# EasyEDA Pro project LCEDAsucai.epro

# Schematic Schematic1

## Sheets
1 BTB: Assembly Variant: Basic; Board Name: tv基板; Create Date: 2026-03-27; Page Name: BTB; Project Name: LCEDAsucaiku; Schematic Name: Schematic1; Update Date: 2026-05-01; Company: 嘉立创EDA; Page Size: A4; Version: V1.0
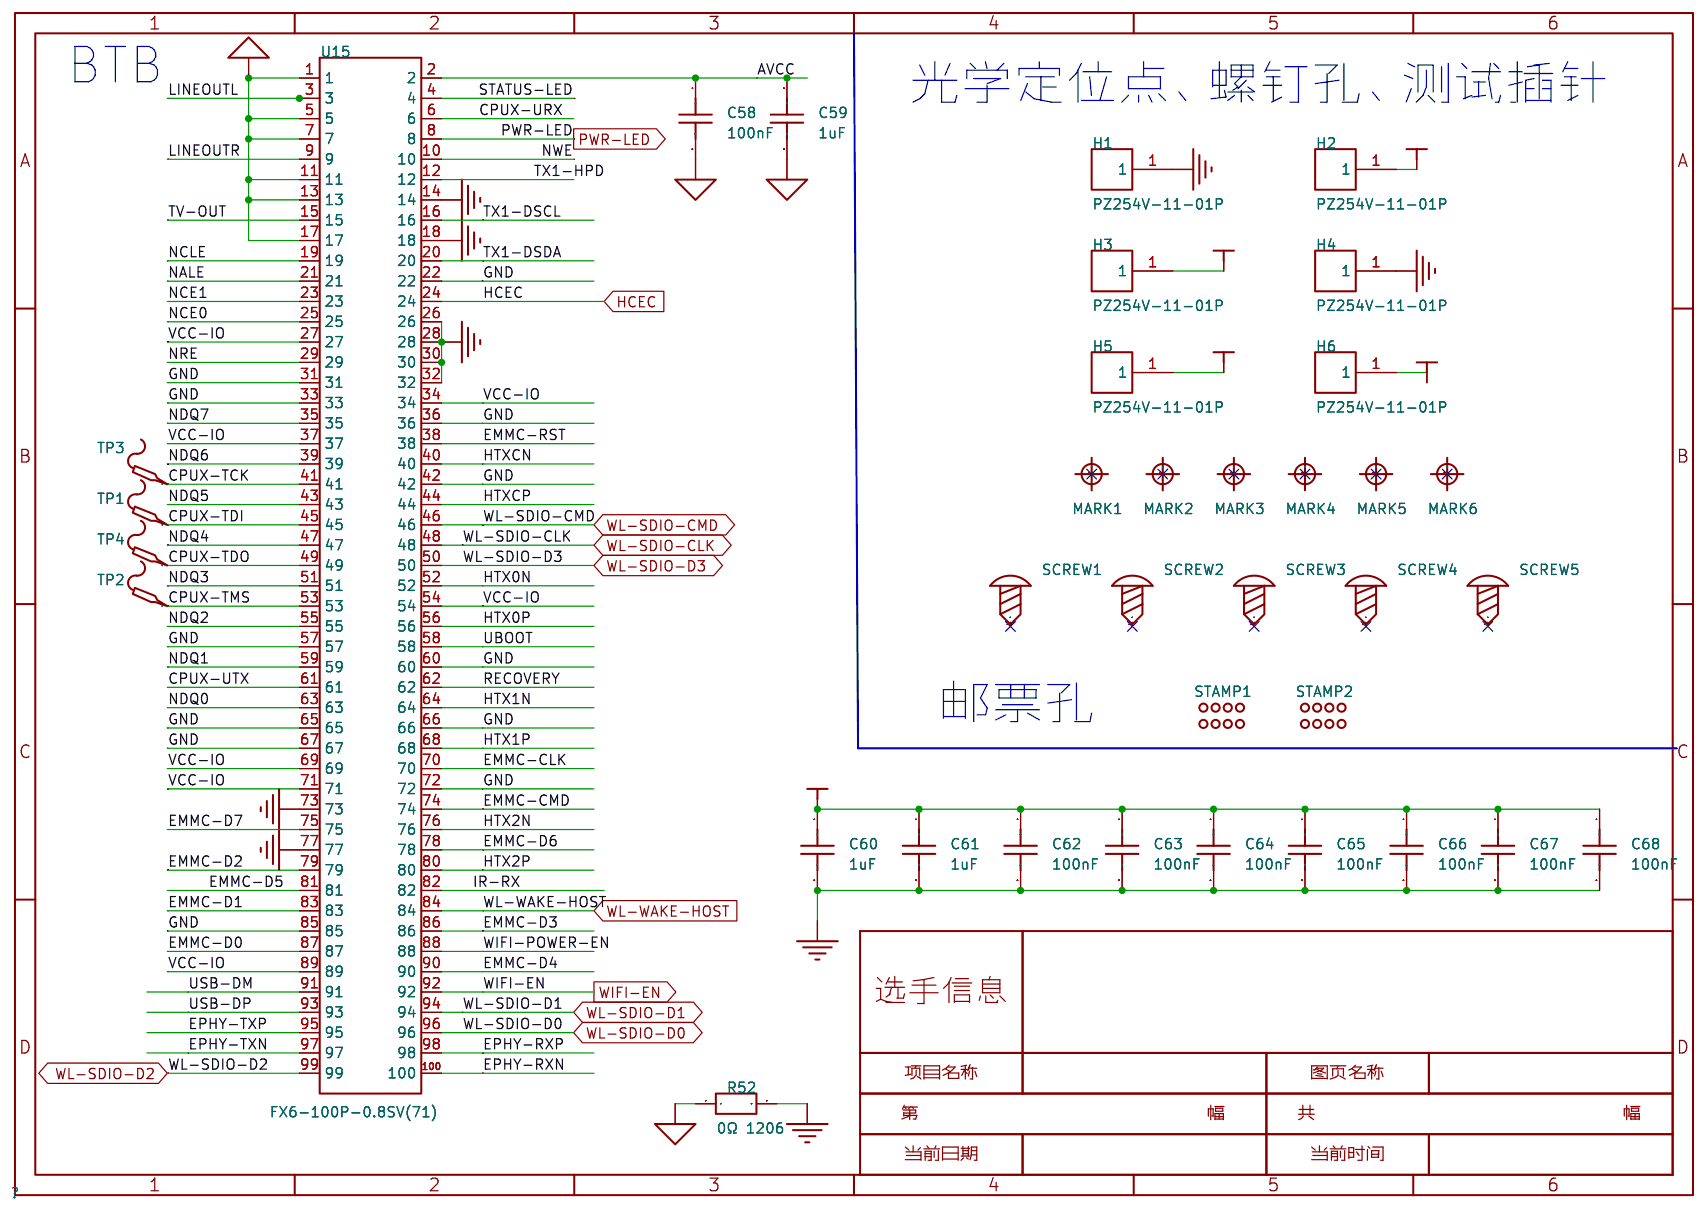
[diagram p0: BTB]
2 PWR: Page Name: PWR
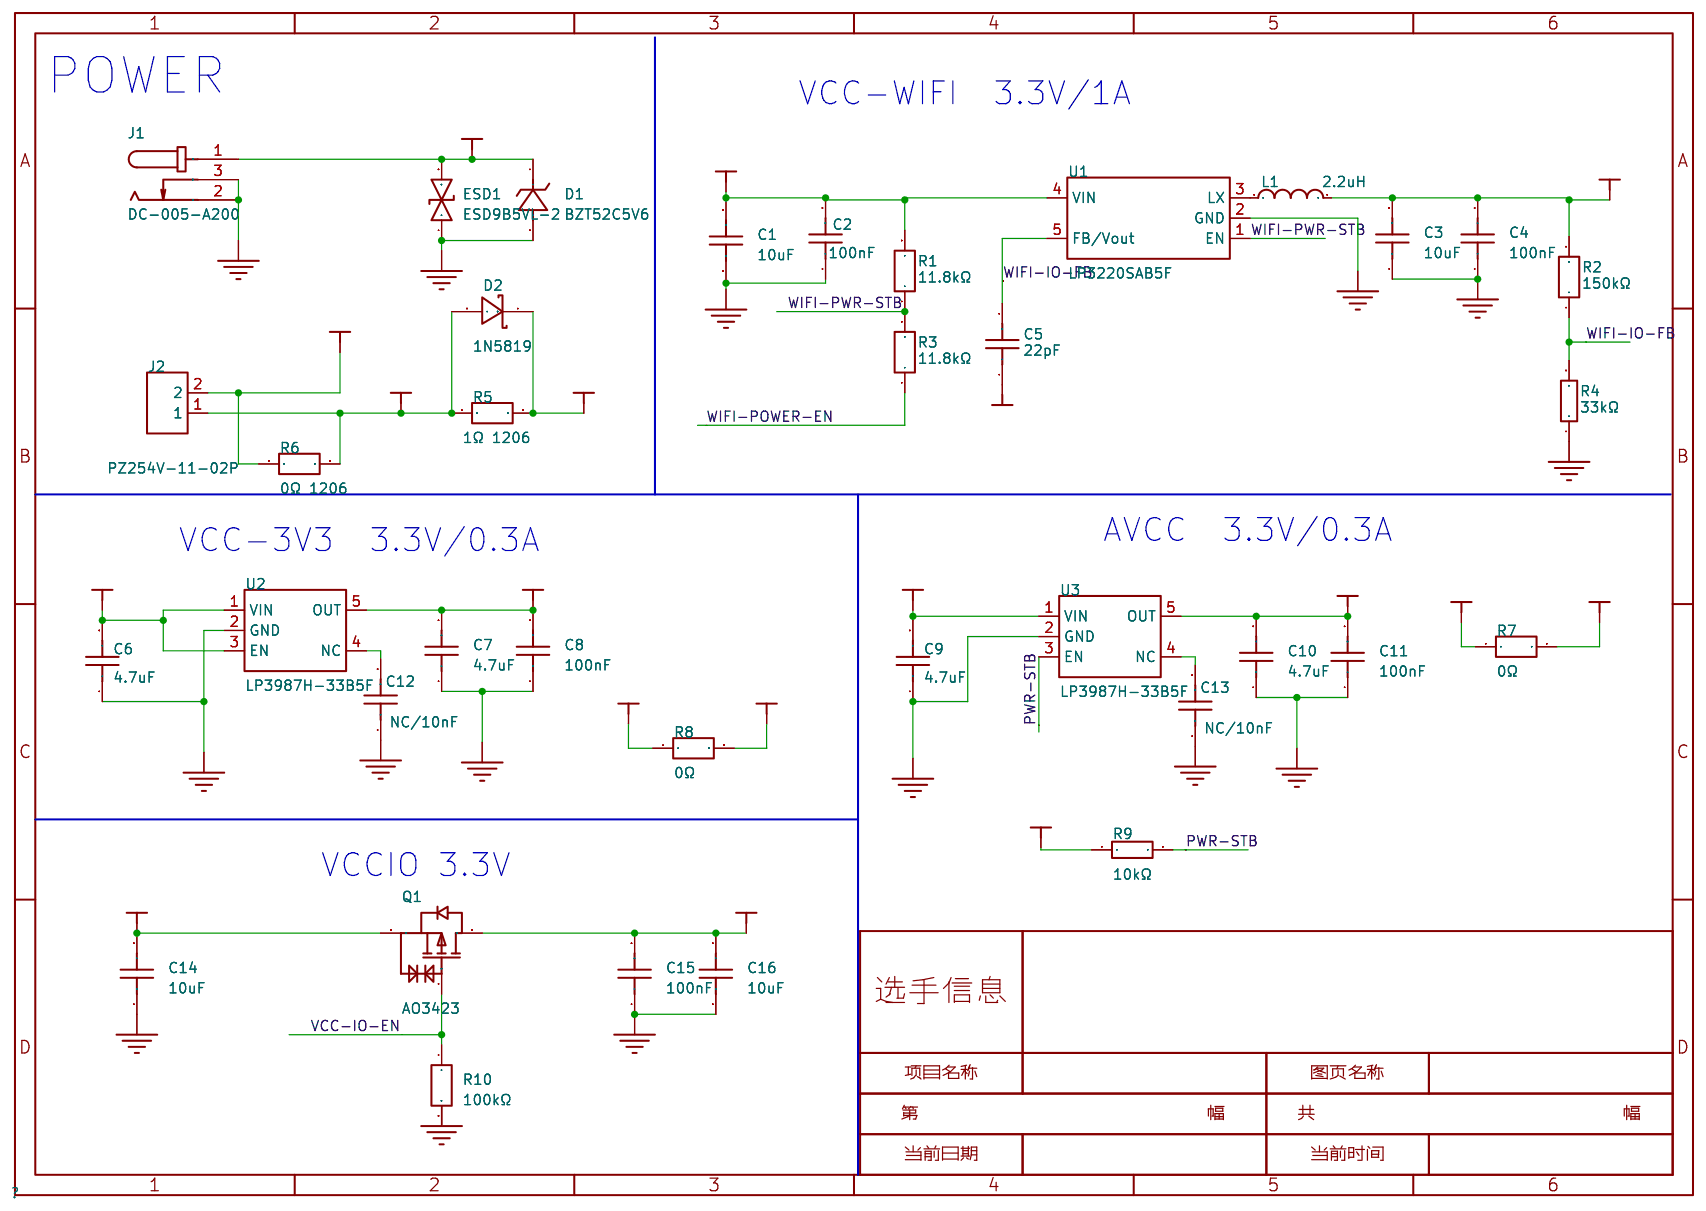
[diagram p1: PWR]
3 NAND-eMMC: Page Name: NAND-eMMC
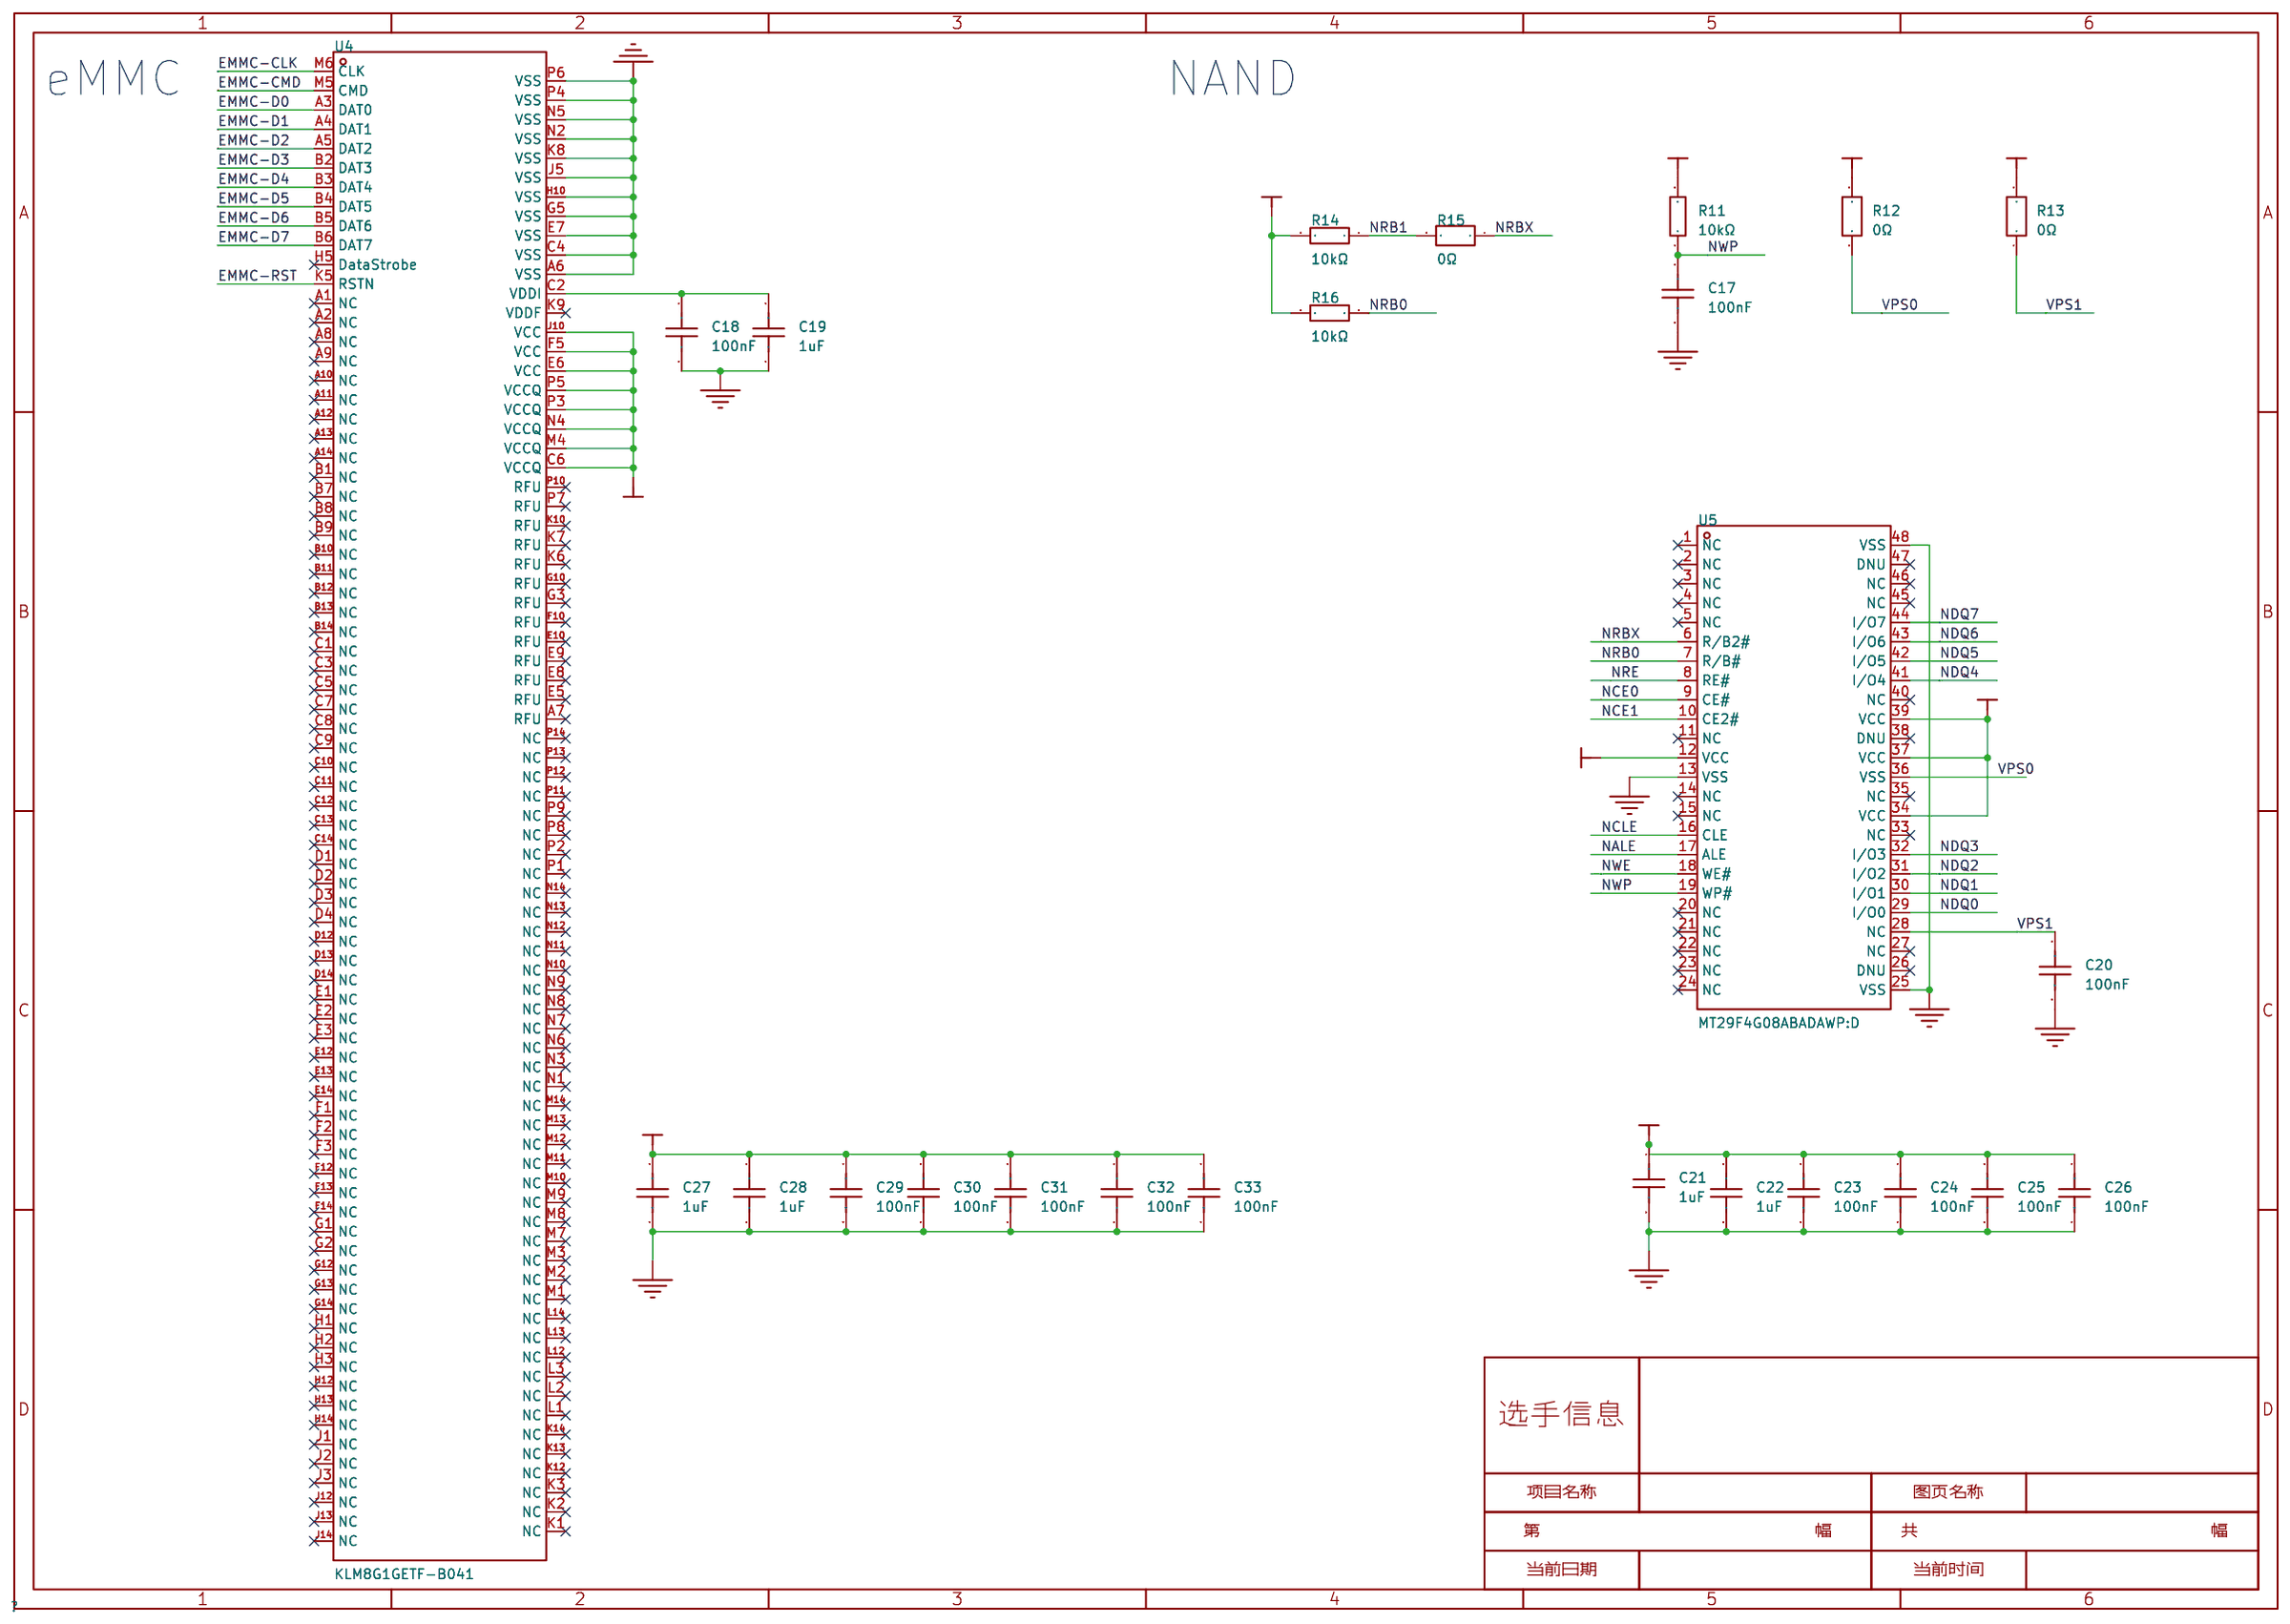
[diagram p2: NAND-eMMC]
4 USB: Page Name: USB
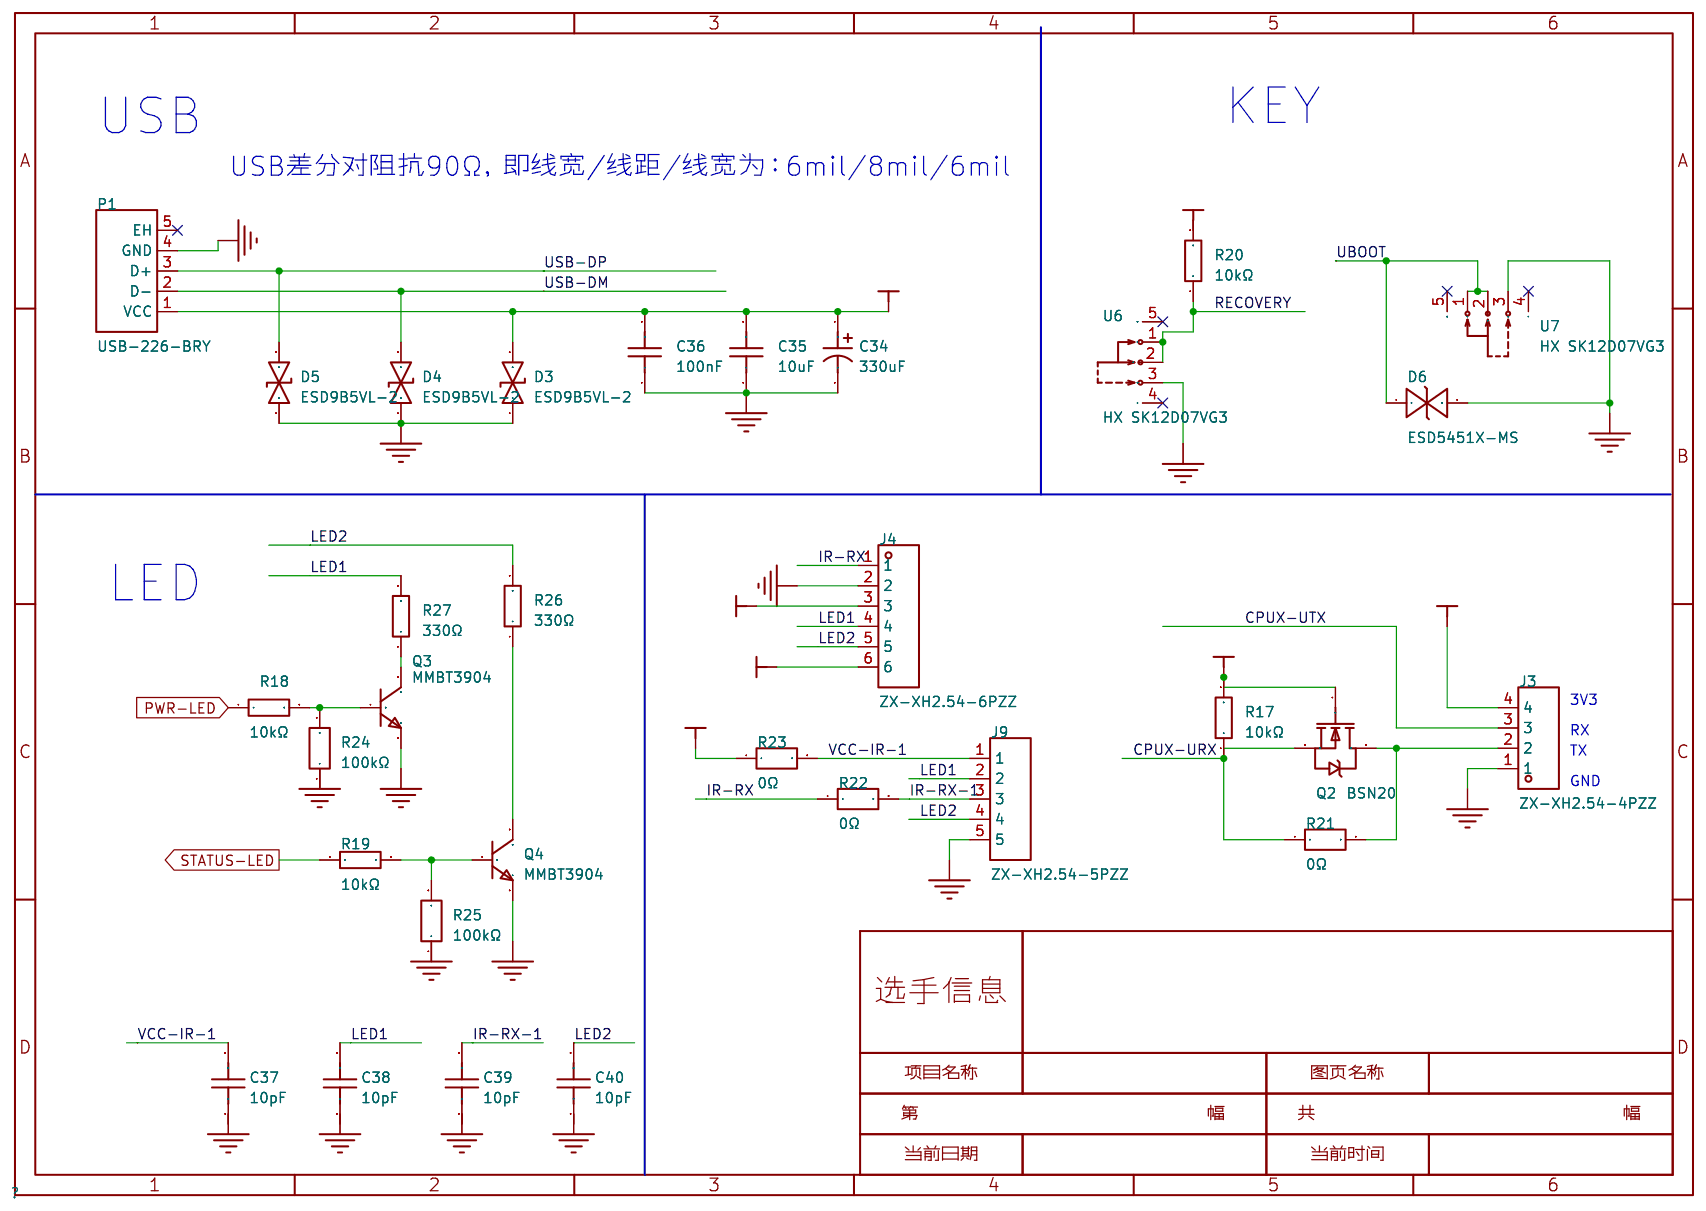
[diagram p3: USB]
5 AV: Page Name: AV
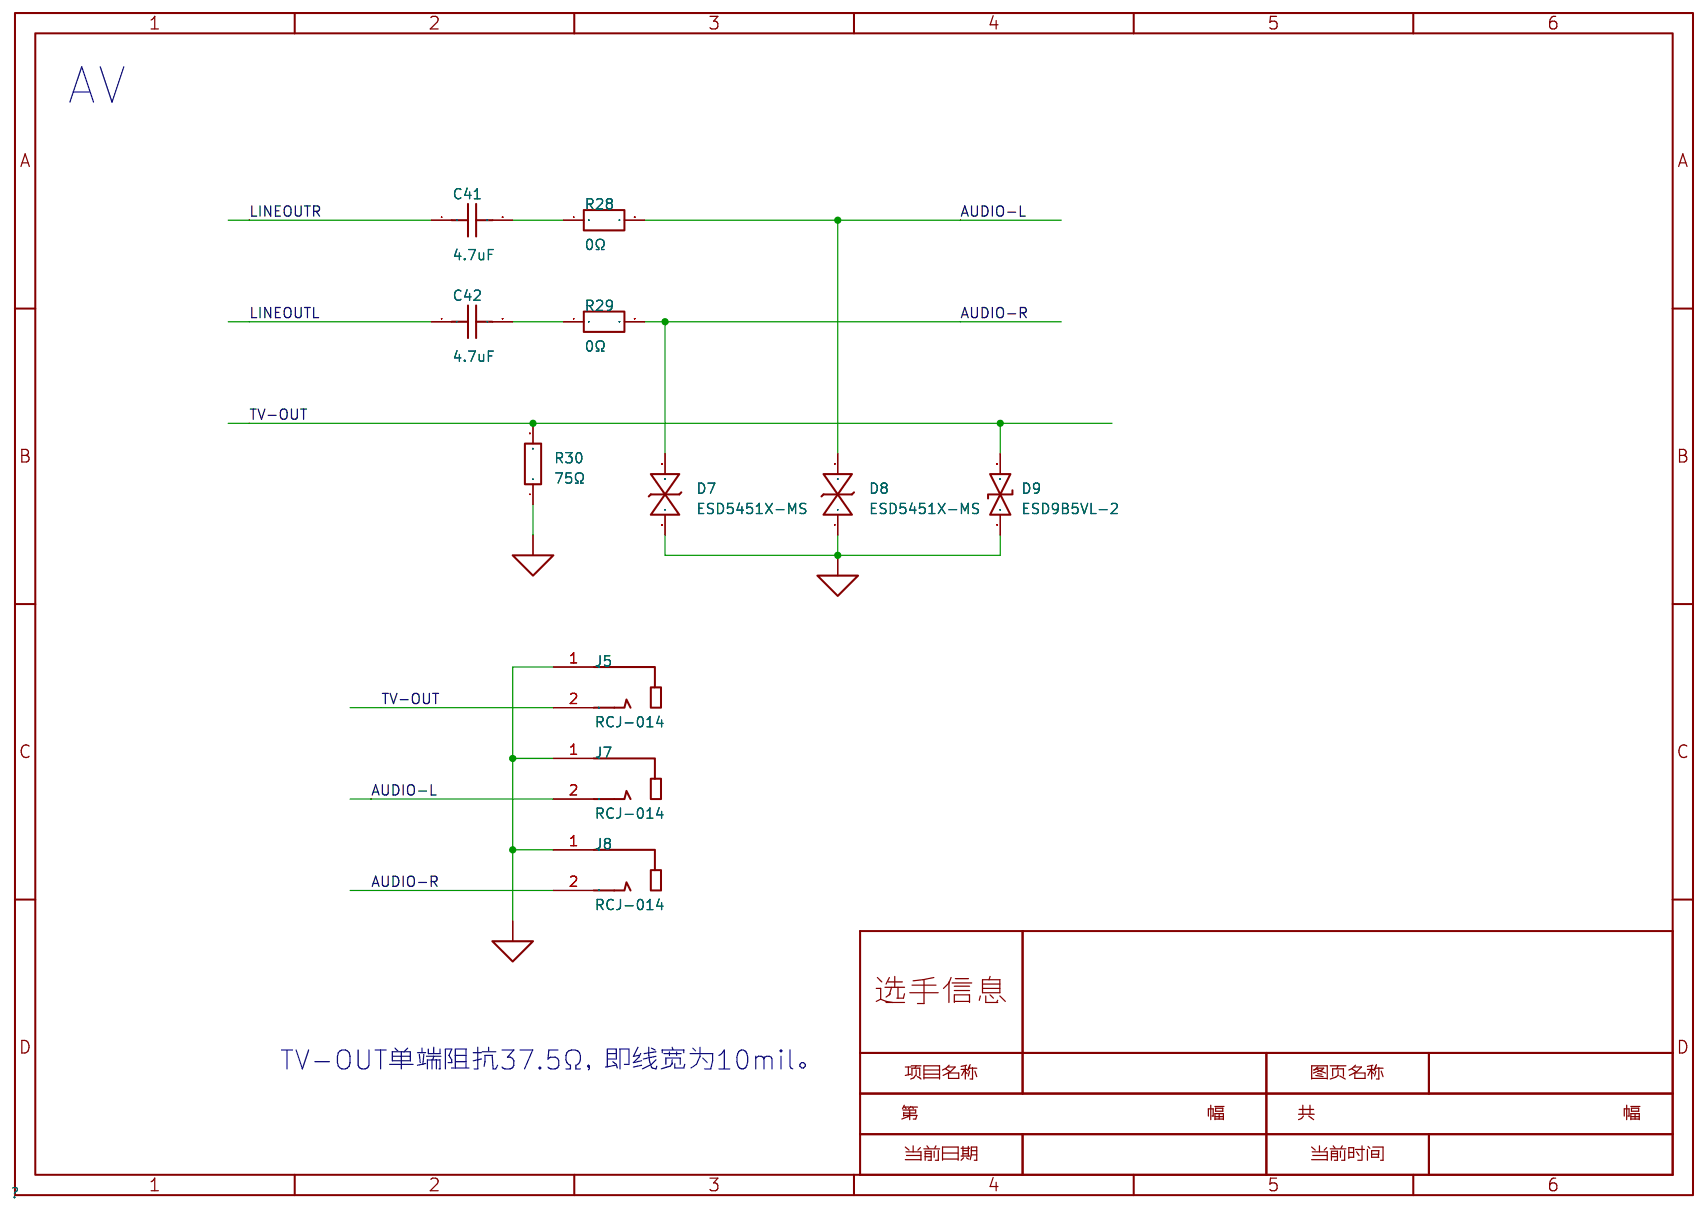
[diagram p4: AV]
6 WIFI: Page Name: WIFI
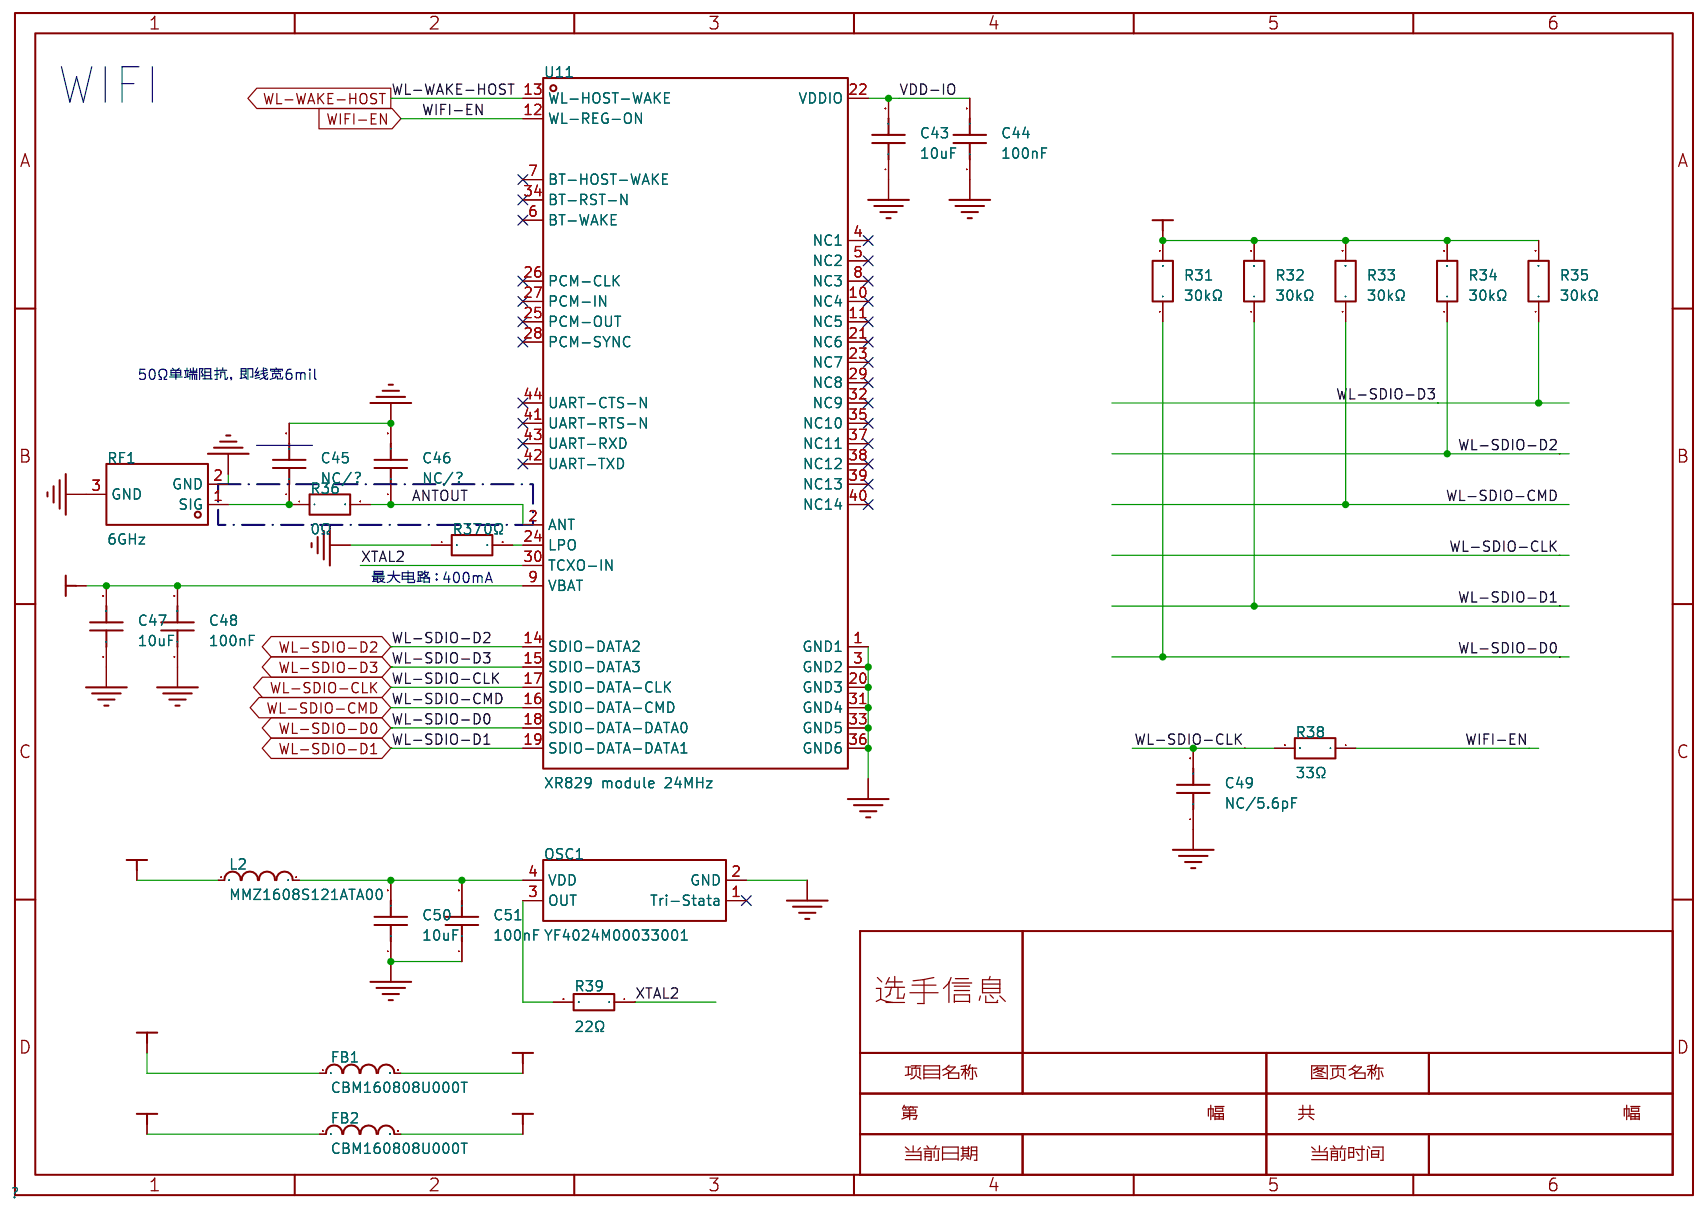
[diagram p5: WIFI]
7 FE-MISC: Page Name: FE-MISC
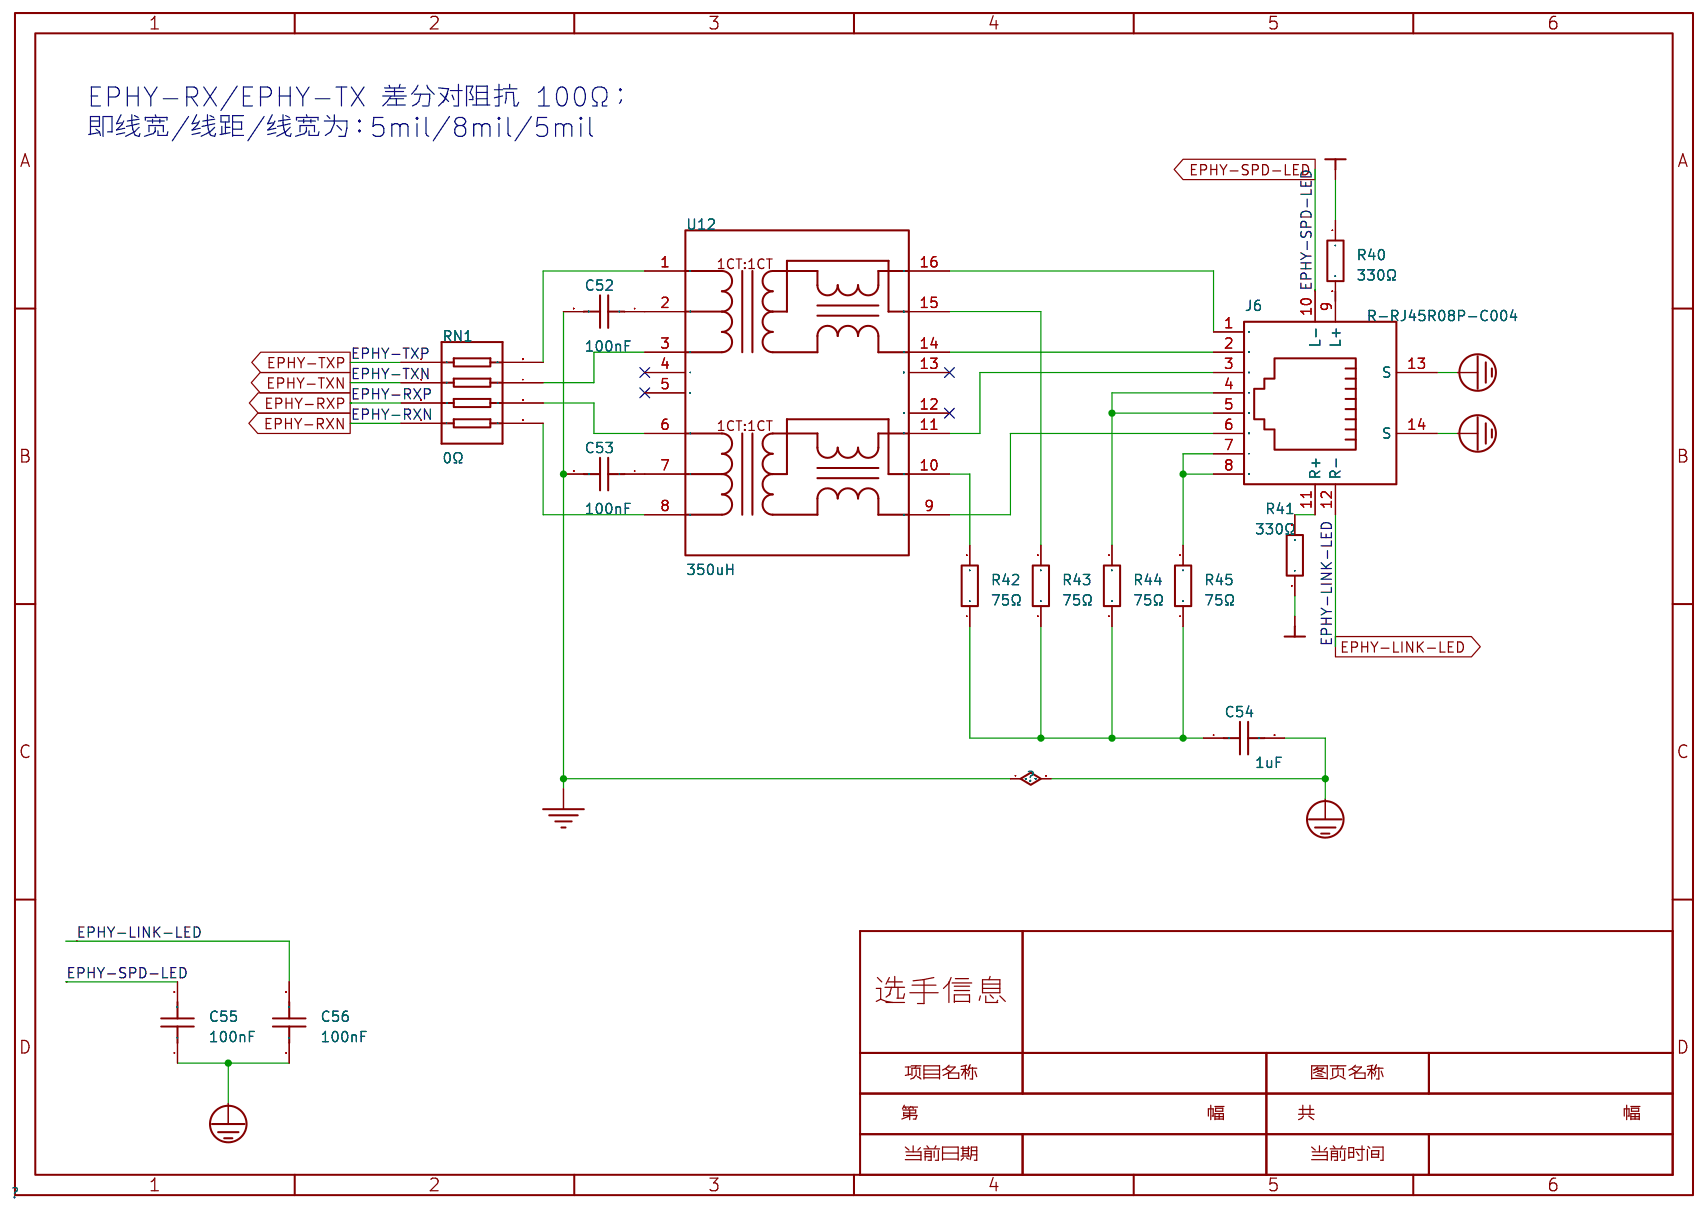
[diagram p6: FE-MISC]
8 HDMI: Page Name: HDMI
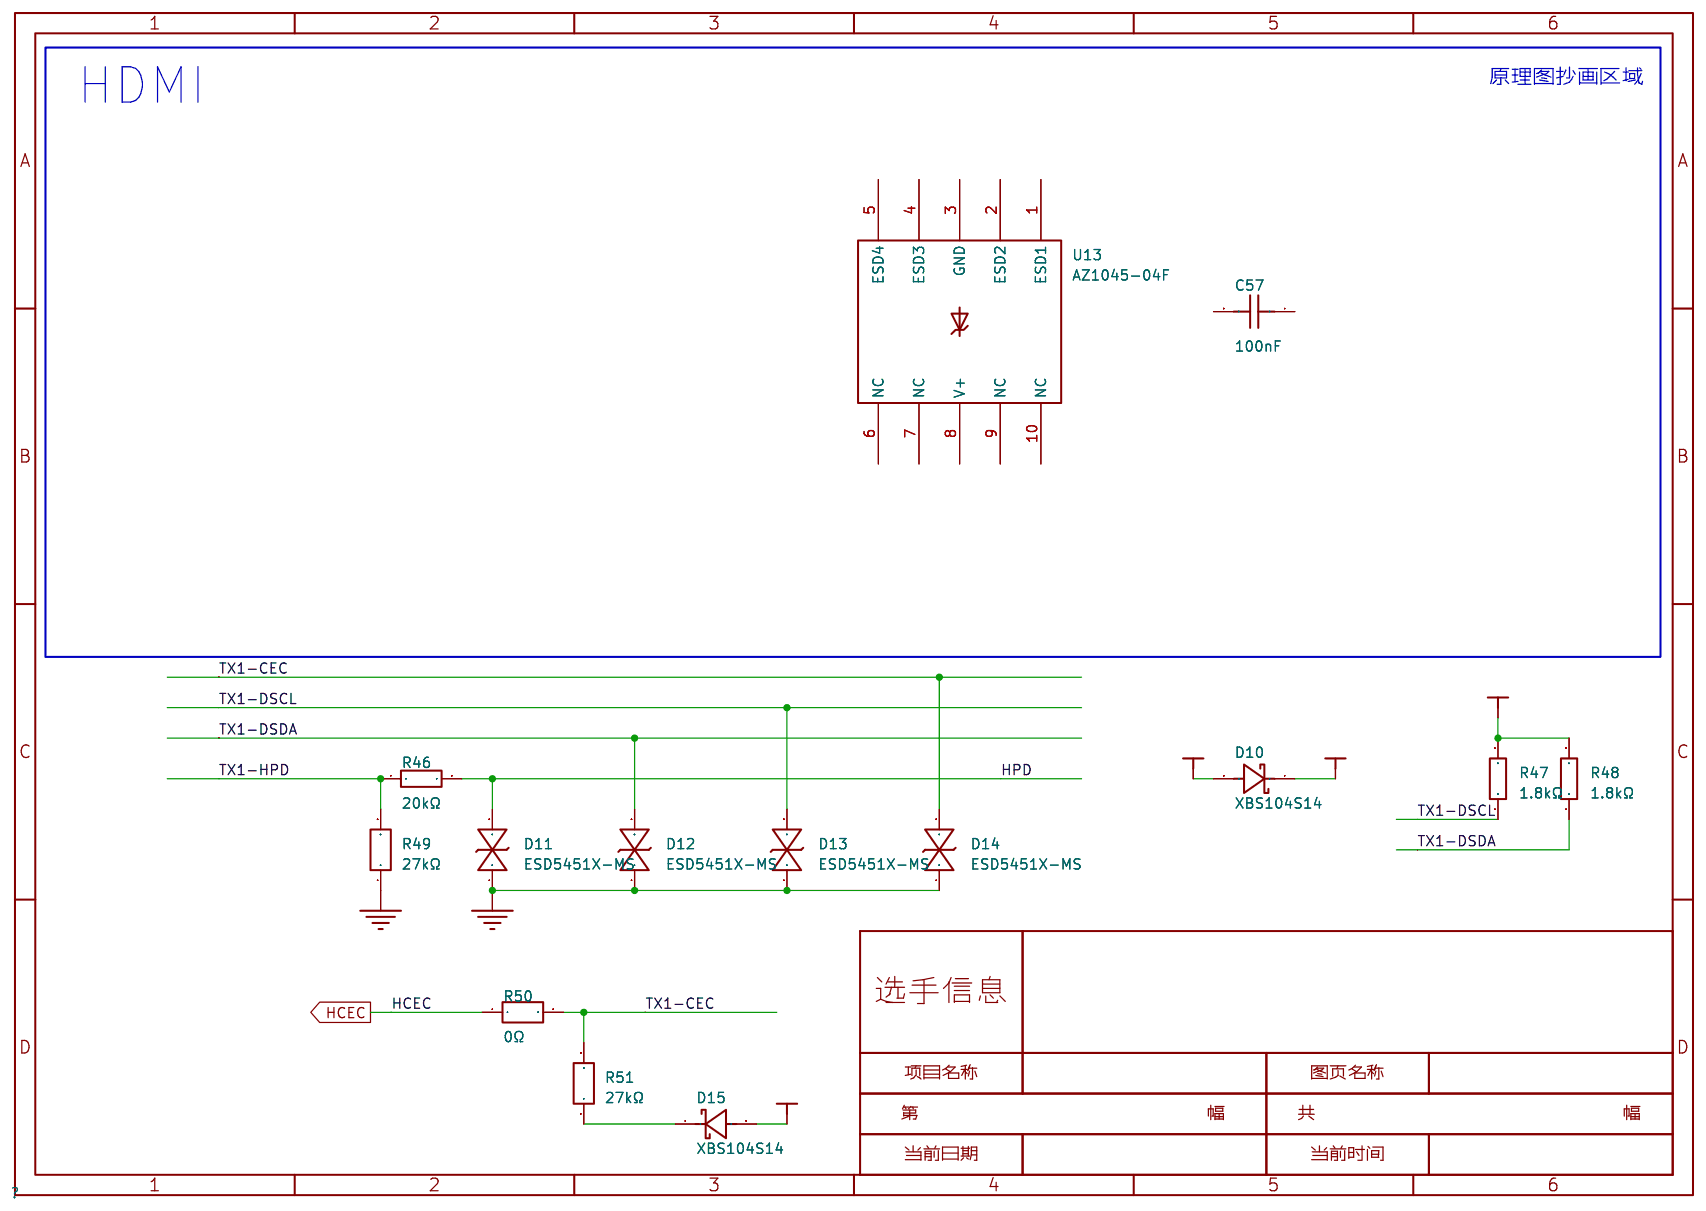
[diagram p7: HDMI]

## Parts
sheet AV
C41  4.7uF  [C0402]
C42  4.7uF  [C0402]
D7  ESD5451X-MS  [DFN1006-2L-BI]
D8  ESD5451X-MS  [DFN1006-2L-BI]
D9  ESD9B5VL-2  [DFN1006-2L-BI]
J5  RCJ-014  [CONN-TH_RCJ-013]
J7  RCJ-014  [CONN-TH_RCJ-013]
J8  RCJ-014  [CONN-TH_RCJ-013]
R28  0Ω  [R0402]
R29  0Ω  [R0402]
R30  75Ω  [R0603]
sheet BTB
C58  100nF  [C0402]
C59  1uF  [C0402]
C60  1uF  [C0402]
C61  1uF  [C0402]
C62  100nF  [C0402]
C63  100nF  [C0402]
C64  100nF  [C0402]
C65  100nF  [C0402]
C66  100nF  [C0402]
C67  100nF  [C0402]
C68  100nF  [C0402]
H1  PZ254V-11-01P  [HDR-TH_1P-P2.54-V-M]
H2  PZ254V-11-01P  [HDR-TH_1P-P2.54-V-M]
H3  PZ254V-11-01P  [HDR-TH_1P-P2.54-V-M]
H4  PZ254V-11-01P  [HDR-TH_1P-P2.54-V-M]
H5  PZ254V-11-01P  [HDR-TH_1P-P2.54-V-M]
H6  PZ254V-11-01P  [HDR-TH_1P-P2.54-V-M]
MARK1  -  [Mark-Point-1mm]  (no BOM)
MARK2  -  [Mark-Point-1mm]  (no BOM)
MARK3  -  [Mark-Point-1mm]  (no BOM)
MARK4  -  [Mark-Point-1mm]  (no BOM)
MARK5  -  [Mark-Point-1mm]  (no BOM)
MARK6  -  [Mark-Point-1mm]  (no BOM)
R52  0Ω 1206  [R1206]
SCREW1  -  [SIP-1A]
SCREW2  -  [SIP-1A]
SCREW3  -  [SIP-1A]
SCREW4  -  [SIP-1A]
SCREW5  -  [SIP-1A]
STAMP1  -  [youpiaokong]
STAMP2  -  [youpiaokong]
TP1  -  [Test-Point-0.5mm]
TP2  -  [Test-Point-0.5mm]
TP3  -  [Test-Point-0.5mm]
TP4  -  [Test-Point-0.5mm]
U15  FX6-100P-0.8SV(71)  [CONN-SMD_100P-P0.80_FX6-100P-0.8SV71]
sheet FE-MISC
C52  100nF  [C0402]
C53  100nF  [C0402]
C54  1uF  [C1206]
C55  100nF  [C0402]
C56  100nF  [C0402]
J6  R-RJ45R08P-C004  [RJ45-TH_R-RJ45R08P-C004]
R40  330Ω  [R0402]
R41  330Ω  [R0402]
R42  75Ω  [R0603]
R43  75Ω  [R0603]
R44  75Ω  [R0603]
R45  75Ω  [R0603]
RN1  0Ω  [RES-ARRAY-SMD_0603-8P-L3.2-W1.6-BL]
U12  350uH  [XFMR-SMD_16P-L12.7-W7.1-P1.27-LS9.4-BL]
sheet HDMI
C57  100nF  [C0402]
D10  XBS104S14  [SOD-123FL_L2.8-W1.8-LS3.7-RD]
D11  ESD5451X-MS  [DFN1006-2L-BI]
D12  ESD5451X-MS  [DFN1006-2L-BI]
D13  ESD5451X-MS  [DFN1006-2L-BI]
D14  ESD5451X-MS  [DFN1006-2L-BI]
D15  XBS104S14  [SOD-123FL_L2.8-W1.8-LS3.7-RD]
R46  20kΩ  [R0402]
R47  1.8kΩ  [R0402]
R48  1.8kΩ  [R0402]
R49  27kΩ  [R0402]
R50  0Ω  [R0402]
R51  27kΩ  [R0402]
U13  AZ1045-04F  [DFN2510-10_L2.5-W1.0-P0.50-BL]
sheet NAND-eMMC
C17  100nF  [C0402]
C18  100nF  [C0402]
C19  1uF  [C0402]
C20  100nF  [C0402]
C21  1uF  [C0402]
C22  1uF  [C0402]
C23  100nF  [C0402]
C24  100nF  [C0402]
C25  100nF  [C0402]
C26  100nF  [C0402]
C27  1uF  [C0402]
C28  1uF  [C0402]
C29  100nF  [C0402]
C30  100nF  [C0402]
C31  100nF  [C0402]
C32  100nF  [C0402]
C33  100nF  [C0402]
R11  10kΩ  [R0402]
R12  0Ω  [R0402]
R13  0Ω  [R0402]
R14  10kΩ  [R0402]
R15  0Ω  [R0402]
R16  10kΩ  [R0402]
U4  KLM8G1GETF-B041  [FBGA-153_L13.0-W11.5-P0.50_KLMAG1JETD-B041]
U5  MT29F4G08ABADAWP:D  [TSOP-48_L18.5-W12.2-P0.50-LS20.0-TL]
sheet PWR
C1  10uF  [C0805]
C2  100nF  [C0402]
C3  10uF  [C0805]
C4  100nF  [C0402]
C5  22pF  [C0402]
C6  4.7uF  [C0402]
C7  4.7uF  [C0402]
C8  100nF  [C0402]
C9  4.7uF  [C0402]
C10  4.7uF  [C0402]
C11  100nF  [C0402]
C12  NC/10nF  [C0402]
C13  NC/10nF  [C0402]
C14  10uF  [C0805]
C15  100nF  [C0402]
C16  10uF  [C0805]
D1  BZT52C5V6  [SOD-123_L2.7-W1.6-LS3.7-RD]
D2  1N5819  [SMA_L4.4-W2.6-LS5.0-RD]
ESD1  ESD9B5VL-2  [DFN1006-2L-BI]
J1  DC-005-A200  [DC-IN-TH_DC-005-A200]
J2  PZ254V-11-02P  [HDR-TH_2P-P2.54-V-M]
L1  2.2uH  [IND-SMD_L4.6-W4.1_MHCI04015]
Q1  AO3423  [SOT-23-3_L2.9-W1.3-P1.90-LS2.4-BR-3]
R1  11.8kΩ  [R0402]
R2  150kΩ  [R0402]
R3  11.8kΩ  [R0402]
R4  33kΩ  [R0402]
R5  1Ω 1206  [R1206]
R6  0Ω 1206  [R1206]
R7  0Ω  [R0402]
R8  0Ω  [R0402]
R9  10kΩ  [R0402]
R10  100kΩ  [R0402]
U1  LP3220SAB5F  [SOT-23-5_L3.0-W1.7-P0.95-LS2.8-BR]
U2  LP3987H-33B5F  [SOT-23-5_L3.0-W1.7-P0.95-LS2.8-BL]
U3  LP3987H-33B5F  [SOT-23-5_L3.0-W1.7-P0.95-LS2.8-BL]
sheet USB
C34  330uF  [CAP-TH_BD6.3-P2.50-D0.6-FD-3]
C35  10uF  [C0805]
C36  100nF  [C0402]
C37  10pF  [C0402]
C38  10pF  [C0402]
C39  10pF  [C0402]
C40  10pF  [C0402]
D3  ESD9B5VL-2  [DFN1006-2L-BI]
D4  ESD9B5VL-2  [DFN1006-2L-BI]
D5  ESD9B5VL-2  [DFN1006-2L-BI]
D6  ESD5451X-MS  [DFN1006-2L-BI]
J3  ZX-XH2.54-4PZZ  [CONN-TH_4P-P2.50_4PIN]
J4  ZX-XH2.54-6PZZ  [CONN-TH_6P-P2.50_ZX-XH2.54-6PZZ]
J9  ZX-XH2.54-5PZZ  [CONN-TH_5P-P2.50_ZX-XH2.54-5PZZ]
P1  USB-226-BRY  [USB-A-TH_USB-226-BRY]
Q2  BSN20  [SOT-23-3_L2.9-W1.6-P1.90-LS2.8-BR]
Q3  MMBT3904  [SOT-23-3_L2.9-W1.3-P1.90-LS2.4-BR]
Q4  MMBT3904  [SOT-23-3_L2.9-W1.3-P1.90-LS2.4-BR]
R17  10kΩ  [R0402]
R18  10kΩ  [R0402]
R19  10kΩ  [R0402]
R20  10kΩ  [R0402]
R21  0Ω  [R0402]
R22  0Ω  [R0402]
R23  0Ω  [R0402]
R24  100kΩ  [R0402]
R25  100kΩ  [R0402]
R26  330Ω  [R0402]
R27  330Ω  [R0402]
U6  HX SK12D07VG3  [SW-TH_SK12D07VG3]
U7  HX SK12D07VG3  [SW-TH_SK12D07VG3]
sheet WIFI
C43  10uF  [C0805]
C44  100nF  [C0402]
C45  NC/？  [C0402]
C46  NC/？  [C0402]
C47  10uF  [C0805]
C48  100nF  [C0402]
C49  NC/5.6pF  [C0402]
C50  10uF  [C0805]
C51  100nF  [C0402]
FB1  CBM160808U000T  [L0603]
FB2  CBM160808U000T  [L0603]
L2  MMZ1608S121ATA00  [L0603]
OSC1  YF4024M00033001  [OSC-SMD_4P-L3.2-W2.5-BL_1C210000BB0F]
R31  30kΩ  [R0402]
R32  30kΩ  [R0402]
R33  30kΩ  [R0402]
R34  30kΩ  [R0402]
R35  30kΩ  [R0402]
R36  0Ω  [R0402]
R37  0Ω  [R0402]
R38  33Ω  [R0402]
R39  22Ω  [R0402]
RF1  6GHz  [IPEX-SMD_BWIPX-1-001E]
U11  XR829 module 24MHz  [WIRELM-SMD_XR829-MODULE-24MHZ]

## Library data of the parts
C6 C7 C9 C10 C41 C42 = GRM155C61E475ME15D: 容值:4.7uF;精度:±20%;额定电压:25V;温度系数:-;; LCSC Part Name: 4.7uF ±20% 25V; Supplier Part: C5718966; Manufacturer: muRata(村田); Supplier Footprint: 0402; JLCPCB Part Class: Extended Part; Datasheet: https://item.szlcsc.com/datasheet/GRM155C61E475ME15D/6643118.html; Supplier: LCSC; Tolerance: ±20%; Voltage Rating: 25V
D6-D8 D11-D14 = ESD5451X-MS: 反向截止电压(Vrwm):5V;峰值脉冲电流(Ipp):8A;击穿电压:5.6V;; LCSC Part Name: 丝印C; Supplier Part: C7379960; Manufacturer: MSKSEMI(美森科); Supplier Footprint: DFN1006-2L; JLCPCB Part Class: Extended Part; Datasheet: https://atta.szlcsc.com/upload/public/pdf/source/20230621/69F6BD434835CFDE06A31A18B4149936.pdf; Supplier: LCSC; Reverse Stand-Off Voltage (Vrwm): 5V; Peak Pulse Current (Ipp): 8A; Breakdown Voltage: 5.6V; Type: ESD
D3-D5 D9 ESD1 = ESD9B5VL-2: 反向截止电压(Vrwm):5V;钳位电压:12.5V;峰值脉冲功率(Ppp):80W@8/20us;击穿电压:6V;; LCSC Part Name: ESD 5V截止; Supplier Part: C5144823; Manufacturer: Leiditech(雷卯电子); Supplier Footprint: DFN1006-2; JLCPCB Part Class: Extended Part; Datasheet: https://item.szlcsc.com/datasheet/ESD9B5VL-2/5766708.html; Supplier: LCSC; Reverse Stand-Off Voltage (Vrwm): 5V; Clamping Voltage: 12.5V; Peak Pulse Power Dissipation (Ppp): 80W@8/20us; Voltage - Breakdown: 6V; Reverse Leakage Current (Ir): 500nA; level of protection: IEC 61000-4-5；IEC 61000-4-2; Type: ESD; Junction Capacitance: 15pF
J5 J7 J8 = RCJ-014: RCA插孔; LCSC Part Name: RCA插孔; Supplier Part: C4991844; Manufacturer: CUI; JLCPCB Part Class: Extended Part; Datasheet: https://item.szlcsc.com/datasheet/RCJ-014/5566715.html; Supplier: LCSC
R7 R8 R12 R13 R15 R21-R23 R28 R29 R36 R37 R50 = FRC0402P000 TS: 电阻类型:厚膜电阻;阻值:0Ω;精度:±5%;功率:62.5mW;工作电压:50V;; LCSC Part Name: 0Ω ±5% 62.5mW 厚膜电阻; Supplier Part: C2906877; Manufacturer: FOJAN(富捷); Supplier Footprint: 0402; JLCPCB Part Class: Extended Part; Supplier: LCSC; Type: 厚膜电阻; Tolerance: ±5%; Power(Watts): 62.5mW; Voltage-Supply(Max): 50V; Operating Temperature: -55℃~+155℃
R30 R42-R45 = 0603WAF750JT5E: 电阻类型:厚膜电阻;阻值:75Ω;精度:±1%;功率:100mW;工作电压:75V;温度系数:±100ppm/℃;; LCSC Part Name: 75Ω ±1% 100mW 厚膜电阻; Supplier Part: C4275; Manufacturer: UNI-ROYAL(厚声); Supplier Footprint: 0603; JLCPCB Part Class: Basic Part; Datasheet: https://item.szlcsc.com/datasheet/0603WAF750JT5E/4682.html; Supplier: LCSC; Type: 厚膜电阻; Tolerance: ±1%; Power(Watts): 100mW; Voltage-Supply(Max): 75V; Temperature Coefficient: ±100ppm/℃; Operating Temperature: -55℃~+155℃
C2 C4 C8 C11-C13 C15 C17 C18 C20 C23-C26 C29-C33 C36 C44-C46 C48 C49 C51-C53 C55-C58 C62-C68 = CL05B104KO5NNNC: 容值:100nF;精度:±10%;额定电压:16V;温度系数:X7R;; LCSC Part Name: 100nF ±10% 16V; Supplier Part: C1525; Manufacturer: SAMSUNG(三星); Supplier Footprint: 0402; JLCPCB Part Class: Basic Part; Datasheet: https://item.szlcsc.com/datasheet/CL05B104KO5NNNC/1877.html; Supplier: LCSC; Tolerance: ±10%; Voltage Rating: 16V; Temperature Coefficient: X7R
C19 C21 C22 C27 C28 C59-C61 = CGA0402X5R105K500GT: 容值:1uF;精度:±10%;额定电压:50V;温度系数:X5R;; LCSC Part Name: 1uF ±10% 50V; Supplier Part: C6119811; Manufacturer: HRE(芯声); Supplier Footprint: 0402; JLCPCB Part Class: Extended Part; Datasheet: https://item.szlcsc.com/datasheet/CGA0402X5R105K500GT/7062517.html; Supplier: LCSC; Tolerance: ±10%; Voltage Rating: 50V; Temperature Coefficient: X5R
H1-H6 = PZ254V-11-01P: 插针结构:1x1P;间距:2.54mm;行距:-;圆针/方针:方针;安装方式:直插;排数:单排;总PIN位数:1P;额定电流:3A;额定电压:250V;配合针长度:6mm;塑高:2.5mm;端接针长度:3mm;触头材质:黄铜;触头镀层:-;工作温度:-40℃~+105℃;颜色:黑色;; LCSC Part Name: 1x1P 间距:2.54mm 方针 直插; Supplier Part: C492400; Manufacturer: XFCN(兴飞); Supplier Footprint: 插件,P=2.54mm; JLCPCB Part Class: Extended Part; Datasheet: https://item.szlcsc.com/datasheet/PZ254V-11-01P/502956.html; Supplier: LCSC; Pin Structure: 1x1P; Pitch: 2.54mm; Circluar Pins/Square Pins: 方针; Mounting Type: 直插; Number of Rows: 单排; Number of Pins: 1P; Current Rating: 3A; Voltage Rating (Max): 250V; Length of Mating Pin: 6mm; Insulation Height: 2.5mm; Length of End Connection Pin: 3mm; Contact Material: 黄铜; Operating Temperature: -40℃~+105℃; Color: 黑色
MARK1-MARK6 = Mark-Point: Mark点
R6 R52 = FRC1206P000 TS: 电阻类型:厚膜电阻;阻值:0Ω;精度:±5%;功率:250mW;工作电压:200V;; LCSC Part Name: 0Ω ±5% 250mW 厚膜电阻; Supplier Part: C2907406; Manufacturer: FOJAN(富捷); Supplier Footprint: 1206; JLCPCB Part Class: Extended Part; Supplier: LCSC; Type: 厚膜电阻; Tolerance: ±5%; Power(Watts): 250mW; Voltage-Supply(Max): 200V; Operating Temperature: -55℃~+155℃
SCREW1-SCREW5 = M3螺丝: Supplier Footprint: 插件
STAMP1 STAMP2 = youpiaokong
TP1-TP4 = Test-Point: Test Point 测试点
U15 = FX6-100P-0.8SV(71): 额定电流:500mA;工作温度:-55℃~+85℃;; Supplier Part: C5121467; Manufacturer: HRS(广濑); Supplier Footprint: SMD-100P; JLCPCB Part Class: Extended Part; Datasheet: https://item.szlcsc.com/datasheet/FX6-100P-0.8SV(71)/5709403.html; Supplier: LCSC; Current Rating: 500mA; Voltage Rating: 100V; Operating Temperature: -55℃~+85℃
C54 = CL31B105KBHNNNE: 容值:1uF;精度:±10%;额定电压:50V;温度系数:X7R;; LCSC Part Name: 1uF ±10% 50V; Supplier Part: C1848; Manufacturer: SAMSUNG(三星); Supplier Footprint: 1206; JLCPCB Part Class: Basic Part; Datasheet: https://item.szlcsc.com/datasheet/CL31B105KBHNNNE/2200.html; Supplier: LCSC; Tolerance: ±10%; Voltage Rating: 50V; Temperature Coefficient: X7R
J6 = R-RJ45R08P-C004: 连接器类型:RJ45插座;安装方式:弯插;端口数量:1;LED:带LED;屏蔽:有屏蔽;等级:-;触头材质:磷青铜;触头镀层:金;工作温度:0℃~+70℃;; LCSC Part Name: 弯插 带LED; Supplier Part: C386759; Manufacturer: Ckmtw(灿科盟); Supplier Footprint: 弯插; JLCPCB Part Class: Extended Part; Datasheet: https://item.szlcsc.com/datasheet/R-RJ45R08P-C004/360866.html; Supplier: LCSC; Connector Type: RJ45插座; Mounting Type: 弯插; Number of Ports: 1; LED: 带LED; Shielding: 有屏蔽; Supplementary Features: 有弹片; Contact Material: 磷青铜; Contact Plating: 金; Operating Temperature: 0℃~+70℃
R26 R27 R40 R41 = 0402WGF3300TCE: 电阻类型:厚膜电阻;阻值:330Ω;精度:±1%;功率:62.5mW;工作电压:50V;温度系数:±100ppm/℃;; LCSC Part Name: 330Ω ±1% 62.5mW 厚膜电阻; Supplier Part: C25104; Manufacturer: UNI-ROYAL(厚声); Supplier Footprint: 0402; JLCPCB Part Class: Basic Part; Datasheet: https://item.szlcsc.com/datasheet/0402WGF3300TCE/25847.html; Supplier: LCSC; Type: 厚膜电阻; Tolerance: ±1%; Power(Watts): 62.5mW; Voltage-Supply(Max): 50V; Temperature Coefficient: ±100ppm/℃; Operating Temperature: -55℃~+155℃
RN1 = 4D03WGJ0000T5E: 电阻器数:4;阻值:0Ω;精度:±5%;单个元件功率:62.5mW;温度系数:±400ppm/℃;; LCSC Part Name: 0Ω ±5%; Supplier Part: C1952; Manufacturer: UNI-ROYAL(厚声); Supplier Footprint: 0603x4; JLCPCB Part Class: Extended Part; Datasheet: https://item.szlcsc.com/datasheet/4D03WGJ0000T5E/2304.html; Supplier: LCSC; Number of Resistors: 4; Tolerance: ±5%; Power(Watts): 62.5mW; Temperature Coefficient: ±400ppm/℃; Number of Pins: 8
U12 = PM44-11BP T-CND: 匝数比:1CT:1CT;速率:10/100M;功能(POE或非POE):POE;; LCSC Part Name: 10/100M单端口变压器模块; Supplier Part: C49023303; Manufacturer: CND-tek(磁联达); Supplier Footprint: SMD-16P,12.7x7mm; JLCPCB Part Class: Extended Part; Datasheet: https://item.szlcsc.com/datasheet/PM44-11BP%2520T-CND/51383028.html; Supplier: LCSC; Turns Ratio: 1CT:1CT; rate: 10/100M; Function: POE; Isolation Voltage(Vrms): 1.5kV; operating temperature: 0℃~+70℃
D10 D15 = XBS104S14: 二极管配置:独立式;正向压降(Vf):490mV@1A;直流反向耐压(Vr):40V;整流电流:1A;; LCSC Part Name: 电压:40V 电流:1A; Supplier Part: C5185949; Manufacturer: Slkor(萨科微); Supplier Footprint: SOD-123FL; JLCPCB Part Class: Extended Part; Datasheet: https://item.szlcsc.com/datasheet/XBS104S14/5856509.html; Supplier: LCSC; Diode Configuration: 独立式; Voltage - Forward(Vf@If): 490mV@1A; Voltage - DC Reverse(Vr): 40V; Current - Rectified: 1A; Reverse Leakage Current (Ir): 4uA@40V; Non-Repetitive Peak Forward Surge Current: 10A
R46 = FRC0402F2002TS: 电阻类型:厚膜电阻;阻值:20kΩ;精度:±1%;功率:62.5mW;工作电压:50V;温度系数:±100ppm/℃;; LCSC Part Name: 20kΩ ±1% 62.5mW 厚膜电阻; Supplier Part: C2906867; Manufacturer: FOJAN(富捷); Supplier Footprint: 0402; JLCPCB Part Class: Extended Part; Datasheet: https://item.szlcsc.com/datasheet/FRC0402F2002TS/3180380.html; Supplier: LCSC; Type: 厚膜电阻; Tolerance: ±1%; Power(Watts): 62.5mW; Voltage-Supply(Max): 50V; Temperature Coefficient: ±100ppm/℃; Operating Temperature: -55℃~+155℃
R47 R48 = 0402WGF1801TCE: 电阻类型:厚膜电阻;阻值:1.8kΩ;精度:±1%;功率:62.5mW;工作电压:50V;温度系数:±100ppm/℃;; LCSC Part Name: 1.8kΩ ±1% 62.5mW 厚膜电阻; Supplier Part: C25871; Manufacturer: UNI-ROYAL(厚声); Supplier Footprint: 0402; JLCPCB Part Class: Extended Part; Datasheet: https://item.szlcsc.com/datasheet/0402WGF1801TCE/26614.html; Supplier: LCSC; Type: 厚膜电阻; Tolerance: ±1%; Power(Watts): 62.5mW; Voltage-Supply(Max): 50V; Temperature Coefficient: ±100ppm/℃; Operating Temperature: -55℃~+155℃
R49 R51 = FRC0402F2702TS: 电阻类型:厚膜电阻;阻值:27kΩ;精度:±1%;功率:62.5mW;工作电压:50V;温度系数:±100ppm/℃;; LCSC Part Name: 27kΩ ±1% 62.5mW 厚膜电阻; Supplier Part: C2933084; Manufacturer: FOJAN(富捷); Supplier Footprint: 0402; JLCPCB Part Class: Extended Part; Supplier: LCSC; Type: 厚膜电阻; Tolerance: ±1%; Power(Watts): 62.5mW; Voltage-Supply(Max): 50V; Temperature Coefficient: ±100ppm/℃; Operating Temperature: -55℃~+155℃
U13 = AZ1045-04F: componentDisplayMode: -1
R9 R11 R14 R16-R20 = RC0402FR-0710KL: 电阻类型:厚膜电阻;阻值:10kΩ;精度:±1%;功率:62.5mW;工作电压:50V;温度系数:±100ppm/℃;; LCSC Part Name: 厚膜电阻 10kΩ ±1% 62.5mW; Supplier Part: C60490; Manufacturer: YAGEO(国巨); Supplier Footprint: 0402; JLCPCB Part Class: Extended Part; Datasheet: https://item.szlcsc.com/datasheet/RC0402FR-0710KL/61542.html; Supplier: LCSC; Type: 厚膜电阻; Tolerance: ±1%; Power(Watts): 62.5mW; Voltage-Supply(Max): 50V; Temperature Coefficient: ±100ppm/℃; Operating Temperature: -55℃~+155℃
U4 = KLM8G1GETF-B041: 配置:-;接口类型:eMMC 5.1;存储容量:8GB;; LCSC Part Name: eMMC 5.1 规格兼容; Supplier Part: C499918; Manufacturer: SAMSUNG(三星半导体); Supplier Footprint: FBGA-153(11.5x13); JLCPCB Part Class: Extended Part; Datasheet: https://item.szlcsc.com/datasheet/KLM8G1GETF-B041/512098.html; Supplier: LCSC; Interface: eMMC 5.1; Memory Size: 8GB; Operating Temperature: -25℃~+85℃; Reading Speed in Sequence: 330MB/S; Writing Speed in Sequence: 50MB/S; NAND Operating Voltage (VCCF): 2.7V~3.6V; Controller Operating Voltage (VCCQ): 2.7V~3.6V；1.7V~1.95V
U5 = MT29F4G08ABADAWP:D: 存储容量:4Gbit;时钟频率(fc):-;工作电压:2.7V~3.6V;; Supplier Part: C78135; Manufacturer: micron(镁光); Supplier Footprint: TSOPI-48; JLCPCB Part Class: Extended Part; Supplier: LCSC; Memory Size: 4Gbit; Interface: Parallel; Voltage - Supply: 2.7V~3.6V; Write Cycle Time(tWC): 20ns; Page Program time (TPP): 200us; Block Erase Time(tBE): 700us; Data Retention - TDR (Year): 10年; Operating Temperature: 0℃~+70℃; Program / Erase Cycles: 10万次
C1 C3 C14 C16 C35 C43 C47 C50 = CGA0805X5R106K500MT: 容值:10uF;精度:±10%;额定电压:50V;温度系数:X5R;; LCSC Part Name: 10uF ±10% 50V; Supplier Part: C6119889; Manufacturer: HRE(芯声); Supplier Footprint: 0805; JLCPCB Part Class: Extended Part; Datasheet: https://item.szlcsc.com/datasheet/CGA0805X5R106K500MT/7062595.html; Supplier: LCSC; Tolerance: ±10%; Voltage Rating: 50V; Temperature Coefficient: X5R
C5 = FCC0402N220J500AT: 容值:22pF;精度:±5%;额定电压:50V;温度系数:C0G;; LCSC Part Name: 22pF ±5% 50V; Supplier Part: C5137569; Manufacturer: FOJAN(富捷); Supplier Footprint: 0402; JLCPCB Part Class: Extended Part; Datasheet: https://item.szlcsc.com/datasheet/FCC0402N220J500AT/5747021.html; Supplier: LCSC; Tolerance: ±5%; Voltage Rating: 50V; Temperature Coefficient: C0G
D1 = BZT52C5V6_C19077402: 二极管配置:独立式;稳压值(标称值):5.6V;稳压值(范围):5.32V~5.88V;耗散功率(Pd):350mW;; LCSC Part Name: 表面贴装齐纳二极管; Supplier Part: C19077402; Manufacturer: R+O(宏嘉诚); Supplier Footprint: SOD-123; JLCPCB Part Class: Extended Part; Datasheet: https://item.szlcsc.com/datasheet/BZT52C5V6/20275487.html; Supplier: LCSC; Diode Configuration: 独立式; Zener Voltage(Nom): 5.6V; Reverse Leakage Current (Ir): 1uA@2.0V; Zener Voltage(Range): 5.32V~5.88V; Pd - Power Dissipation: 350mW; Impedance(Zzt): 40Ω; Impedance(Zzk): 400Ω; Operating Junction Temperature Range: -55℃~+150℃
D2 = 1N5819_C437199: 正向压降(Vf):500mV@1A;直流反向耐压(Vr):40V;整流电流:1A;; LCSC Part Name: KEXIN(科信)原型号 SS14,后续变更为 1N5819，丝印不变。 电压:40V 电流:1A; Supplier Part: C437199; Manufacturer: KEXIN(科信); Supplier Footprint: DO-214AC(SMA); JLCPCB Part Class: Extended Part; Datasheet: https://item.szlcsc.com/datasheet/1N5819/435098.html; Supplier: LCSC; Voltage - Forward(Vf@If): 500mV@1A; Voltage - DC Reverse(Vr): 40V; Current - Rectified: 1A; Operating Junction Temperature Range: -60℃~+125℃; Non-Repetitive Peak Forward Surge Current: 40A
J1 = DC-005-A200: 连接器类型:DC电源插座;安装方式:弯插;触点内径:2mm;触点外径:6.4mm;额定电流:3A;额定电压:30V;工作温度:-20℃~+70℃;; LCSC Part Name: DC电源插座 内径:2mm 外径:6.4mm; Supplier Part: C720557; Manufacturer: XUNPU(讯普); Supplier Footprint: 插件; JLCPCB Part Class: Extended Part; Datasheet: https://item.szlcsc.com/datasheet/DC-005-A200/763564.html; Supplier: LCSC; Connector Type: DC电源插座; Mounting Type: 弯插; Inside Contact Diameter: 2mm; Outside Contact Diameter: 6.4mm; Current Rating: 3A; Voltage Rating (Max): 30V; Operating Temperature: -20℃~+70℃
J2 = PZ254V-11-02P: 插针结构:1x2P;间距:2.54mm;行距:-;圆针/方针:方针;安装方式:直插;排数:单排;总PIN位数:2P;额定电流:3A;额定电压:250V;配合针长度:6mm;塑高:2.5mm;端接针长度:3mm;触头材质:黄铜;触头镀层:-;工作温度:-40℃~+105℃;颜色:黑色;; LCSC Part Name: 1x2P 间距:2.54mm 方针 直插; Supplier Part: C492401; Manufacturer: XFCN(兴飞); Supplier Footprint: 插件,P=2.54mm; JLCPCB Part Class: Extended Part; Datasheet: https://item.szlcsc.com/datasheet/PZ254V-11-02P/502957.html; Supplier: LCSC; Pin Structure: 1x2P; Pitch: 2.54mm; Circluar Pins/Square Pins: 方针; Mounting Type: 直插; Number of Rows: 单排; Number of Pins: 2P; Current Rating: 3A; Voltage Rating (Max): 250V; Length of Mating Pin: 6mm; Insulation Height: 2.5mm; Length of End Connection Pin: 3mm; Contact Material: 黄铜; Operating Temperature: -40℃~+105℃; Color: 黑色
L1 = SRG0420-2R2-M: 电感值:2.2uH;精度:±20%;额定电流:4A;饱和电流(Isat):5A;类型:一体成型电感;; LCSC Part Name: 2.2μH ±20% 5A; Supplier Part: C53462916; Manufacturer: JIERR(捷而瑞); Supplier Footprint: SMD,4.6x4.1mm; JLCPCB Part Class: Extended Part; Datasheet: https://item.szlcsc.com/datasheet/SRG0420-2R2-M/56628161.html; Supplier: LCSC; Tolerance: ±20%; Current Rating: 4A; Current - Saturation(Isat): 5A; DC Resistance(DCR): 49mΩ; Type: 一体成型电感
Q1 = AO3423_C19268144: 漏源电压(Vdss):20V;连续漏极电流(Id):3A;导通电阻(RDS(on)@Vgs,Id):125mΩ@2.5V,2A;功率(Pd):1.55W;阈值电压(Vgs(th)@Id):1.1V@3A;; LCSC Part Name: 耐压:20V 电流:3A; Supplier Part: C19268144; Manufacturer: TECH PUBLIC(台舟); Supplier Footprint: SOT-23; JLCPCB Part Class: Extended Part; Datasheet: https://atta.szlcsc.com/upload/public/pdf/source/20231201/DEC71D908761248026A69CF2D48D0084.pdf; Supplier: LCSC; Drain Source Voltage (Vdss): 20V; Continuous Drain Current (Id): 3A; Drain Source On Resistance (RDS(on)@Vgs,Id): 125mΩ@2.5V,2A; Power Dissipation (Pd): 1.55W; Gate Threshold Voltage (Vgs(th)@Id): 1.1V@3A; Input Capacitance (Ciss@Vds): 520pF@16V; Reverse Transfer Capacitance (Crss@Vds): 80pF@16V; Operating Temperature: -55℃~+150℃
R1 R3 = FRC0402F1182TS: 电阻类型:厚膜电阻;阻值:11.8kΩ;精度:±1%;功率:62.5mW;工作电压:50V;温度系数:±100ppm/℃;; LCSC Part Name: 11.8kΩ ±1% 62.5mW 厚膜电阻; Supplier Part: C2929934; Manufacturer: FOJAN(富捷); Supplier Footprint: 0402; JLCPCB Part Class: Extended Part; Supplier: LCSC; Type: 厚膜电阻; Tolerance: ±1%; Power(Watts): 62.5mW; Voltage-Supply(Max): 50V; Temperature Coefficient: ±100ppm/℃; Operating Temperature: -55℃~+155℃
R2 = FRC0402F1503TS: 电阻类型:厚膜电阻;阻值:150kΩ;精度:±1%;功率:62.5mW;工作电压:50V;温度系数:±100ppm/℃;; LCSC Part Name: 150kΩ ±1% 62.5mW 厚膜电阻; Supplier Part: C2909320; Manufacturer: FOJAN(富捷); Supplier Footprint: 0402; JLCPCB Part Class: Extended Part; Supplier: LCSC; Type: 厚膜电阻; Tolerance: ±1%; Power(Watts): 62.5mW; Voltage-Supply(Max): 50V; Temperature Coefficient: ±100ppm/℃; Operating Temperature: -55℃~+155℃
R4 = 0402WGF3302TCE: 电阻类型:厚膜电阻;阻值:33kΩ;精度:±1%;功率:62.5mW;最大工作电压:50V;温度系数:±100ppm/℃;; LCSC Part Name: 33kΩ ±1% 62.5mW 厚膜电阻; Supplier Part: C25779; Manufacturer: UNI-ROYAL(厚声); Supplier Footprint: 0402; JLCPCB Part Class: Basic Part; Datasheet: https://atta.szlcsc.com/upload/public/pdf/source/20200306/C422600_1E6D84923E4A46A82E41ADD87F860B5C.pdf; Supplier: LCSC; Type: 厚膜电阻; Tolerance: ±1%; Power(Watts): 62.5mW; Overload Voltage (Max): 50V; Temperature Coefficient: ±100ppm/℃; Operating Temperature Range: -55℃~+155℃
R5 = FRC1206J1R0 TS: 电阻类型:厚膜电阻;阻值:1Ω;精度:±5%;功率:250mW;工作电压:200V;温度系数:±200ppm/℃;; LCSC Part Name: 1Ω ±5% 250mW 厚膜电阻; Supplier Part: C2907442; Manufacturer: FOJAN(富捷); Supplier Footprint: 1206; JLCPCB Part Class: Extended Part; Datasheet: https://item.szlcsc.com/datasheet/FRC1206J1R0%2520TS/3180955.html; Supplier: LCSC; Type: 厚膜电阻; Tolerance: ±5%; Power(Watts): 250mW; Voltage-Supply(Max): 200V; Temperature Coefficient: ±200ppm/℃; Operating Temperature: -55℃~+155℃
R10 R24 R25 = RT0402BRD07100KL: 电阻类型:薄膜电阻;阻值:100kΩ;精度:±0.1%;功率:62.5mW;最大工作电压:50V;温度系数:±25ppm/℃;; LCSC Part Name: 薄膜电阻 100kΩ ±0.1% 62.5mW; Supplier Part: C852472; Manufacturer: YAGEO(国巨); Supplier Footprint: 0402; JLCPCB Part Class: Extended Part; Datasheet: https://atta.szlcsc.com/upload/public/pdf/source/20210326/C852472_6283D268A9C33EA67274729CC55E28B1.pdf; Supplier: LCSC; Type: 薄膜电阻; Tolerance: ±0.1%; Power(Watts): 62.5mW; Overload Voltage (Max): 50V; Temperature Coefficient: ±25ppm/℃; Operating Temperature Range: -55℃~+155℃
U1 = LP3220SAB5F: 功能类型:降压型;工作电压:2.2V~5.5V;输出电压:610mV~5.5V;输出电流:1A;输出类型:可调;; LCSC Part Name: 1.5MHz 1.0A 降压转换器; Supplier Part: C517212; Manufacturer: LOWPOWER(微源半导体); Supplier Footprint: SOT-23-5; JLCPCB Part Class: Extended Part; Datasheet: https://item.szlcsc.com/datasheet/LP3220SAB5F/533577.html; Supplier: LCSC; Function: 降压型; Voltage - Supply: 2.2V~5.5V; Output Voltage: 610mV~5.5V; Output Current: 1A; Frequency - Switching: 1.5MHz; Operating Temperature: -40℃~+85℃@(TA); Synchronous Rectifier: 是; Number of Outputs: 1; Topology: 降压式; Quiescent Current: 70uA; Switch tube (built-in/external): 内置; Output Type: 可调
U2 U3 = LP3987H-33B5F: 输出类型:固定;工作电压:6V;输出电压:3.3V;输出电流:600mA;电源纹波抑制比(PSRR):65dB@(1kHz);输出极性:正极;; LCSC Part Name: 600mA，超低噪声、超快速CMOS低压差线性稳压器; Supplier Part: C517256; Manufacturer: LOWPOWER(微源半导体); Supplier Footprint: SOT-23-5; JLCPCB Part Class: Extended Part; Datasheet: https://item.szlcsc.com/datasheet/LP3987H-33B5F/533621.html; Supplier: LCSC; Output Type: 固定; Voltage - Supply: 6V; Output Voltage: 3.3V; Output Current: 600mA; Power Supply Rejection Ratio (PSRR): 65dB@(1kHz); Voltage Dropout: 480mV@(600mA); standby current: 130uA; Noise: 100uVrms; Features: 带使能；过热保护；过流保护; Operating Temperature: -40℃~+125℃@(Tj); Output Configuration: 正极; Number of Outputs: 1
C34 = PB16V330M6X11: 容值:330uF;精度:±20%;额定电压:16V;纹波电流:4.1A@100kHz;等效串联电阻(ESR):16mΩ@100kHz;类型:聚合物;; LCSC Part Name: 330uF ±20% 16V; Supplier Part: C51934161; Manufacturer: JIERR(捷而瑞); Supplier Footprint: 插件,D6.3xL11mm; JLCPCB Part Class: Extended Part; Datasheet: https://item.szlcsc.com/datasheet/PB16V330M6X11/54649573.html; Supplier: LCSC; Tolerance: ±20%; Voltage Rating: 16V; Ripple Current: 4.1A@100kHz; Equivalent Series Resistance(ESR): 16mΩ@100kHz; Type: 聚合物; Pin Spacing: 2.5mm; Diameter: 6.3mm; Height - Seated (Max): 11mm; Lifetime: 5000hrs@105℃; Operating Temperature: -55℃~+105℃
C37-C40 = CL05C100JB5NNNC: 容值:10pF;精度:±5%;额定电压:50V;温度系数:C0G;; LCSC Part Name: 10pF ±5% 50V; Supplier Part: C32949; Manufacturer: SAMSUNG(三星); Supplier Footprint: 0402; JLCPCB Part Class: Basic Part; Datasheet: https://item.szlcsc.com/datasheet/CL05C100JB5NNNC/33914.html; Supplier: LCSC; Tolerance: ±5%; Voltage Rating: 50V; Temperature Coefficient: C0G
J3 = ZX-XH2.54-4PZZ: 插针结构:1x4P;间距:2.5mm;安装方式:直插;参考系列:XH;总PIN数:4P;排数:1;每排PIN数:4;行距:-;额定电流:3A;触头材质:黄铜;触头镀层:锡;工作温度:-25℃~+85℃;; LCSC Part Name: 1x4P 间距:2.5mm 直插 系列:XH; Supplier Part: C7429634; Manufacturer: Megastar(兆星); Supplier Footprint: 插件,P=2.5mm; JLCPCB Part Class: Extended Part; Datasheet: https://item.szlcsc.com/datasheet/ZX-XH2.54-4PZZ/8427551.html; Supplier: LCSC; Pins Structure: 1x4P; Pitch: 2.5mm; Mounting Type: 直插; Reference Series: XH; Number of Pins: 4P; Number of Rows: 1; Number of PINs Per Row: 4; Current Rating: 3A; Contact Material: 黄铜; Contact Plating: 锡; Operating Temperature: -25℃~+85℃; Voltage Rating: 250V; Plastic Material: PA66; Flame Retardant Rating: UL94V-0; Color: 白色; Z-Height of the Board: 7mm; X-Length of Bottom Edge on Board (Spacing Line): 12.5mm; Y-Width of Bottom Edge on Board: 5.9mm
J4 = ZX-XH2.54-6PZZ: 插针结构:1x6P;间距:2.5mm;安装方式:直插;参考系列:XH;总PIN数:6P;排数:1;每排PIN数:6;行距:-;额定电流:3A;触头材质:黄铜;触头镀层:锡;工作温度:-25℃~+85℃;; LCSC Part Name: 1x6P 间距:2.5mm 直插 系列:XH; Supplier Part: C7429636; Manufacturer: Megastar(兆星); Supplier Footprint: 插件,P=2.5mm; JLCPCB Part Class: Extended Part; Datasheet: https://item.szlcsc.com/datasheet/ZX-XH2.54-6PZZ/8427553.html; Supplier: LCSC; Pins Structure: 1x6P; Pitch: 2.5mm; Mounting Type: 直插; Reference Series: XH; Number of Pins: 6P; Number of Rows: 1; Number of PINs Per Row: 6; Current Rating: 3A; Contact Material: 黄铜; Contact Plating: 锡; Operating Temperature: -25℃~+85℃; Voltage Rating: 250V; Plastic Material: PA66; Flame Retardant Rating: UL94V-0; Color: 白色; Z-Height of the Board: 7mm; X-Length of Bottom Edge on Board (Spacing Line): 17.5mm; Y-Width of Bottom Edge on Board: 5.9mm
J9 = ZX-XH2.54-5PZZ: 插针结构:1x5P;间距:2.5mm;安装方式:直插;参考系列:XH;总PIN数:5P;排数:1;每排PIN数:5;行距:-;额定电流:3A;触头材质:黄铜;触头镀层:锡;工作温度:-25℃~+85℃;; LCSC Part Name: 1x5P 间距:2.5mm 直插 系列:XH; Supplier Part: C7429635; Manufacturer: Megastar(兆星); Supplier Footprint: 插件,P=2.5mm; JLCPCB Part Class: Extended Part; Datasheet: https://item.szlcsc.com/datasheet/ZX-XH2.54-5PZZ/8427552.html; Supplier: LCSC; Pins Structure: 1x5P; Pitch: 2.5mm; Mounting Type: 直插; Reference Series: XH; Number of Pins: 5P; Number of Rows: 1; Number of PINs Per Row: 5; Current Rating: 3A; Contact Material: 黄铜; Contact Plating: 锡; Operating Temperature: -25℃~+85℃; Voltage Rating: 250V; Plastic Material: PA66; Flame Retardant Rating: UL94V-0; Color: 白色; Z-Height of the Board: 7mm; X-Length of Bottom Edge on Board (Spacing Line): 15mm; Y-Width of Bottom Edge on Board: 5.9mm
P1 = USB-226-BRY: 连接器类型:Type-A;协议标准:USB 2.0;公母:母;安装方式:侧插;触点数量:4P;端口数量:1;额定电流 - 电源:1.5A;工作温度:-20℃~+70℃;; LCSC Part Name: Type-A 母 侧插; Supplier Part: C720523; Manufacturer: XUNPU(讯普); Supplier Footprint: 插件; JLCPCB Part Class: Extended Part; Datasheet: https://item.szlcsc.com/datasheet/USB-226-BRY/763530.html; Supplier: LCSC; Connector Type: Type-A; Protocol Standard: USB 2.0; Gender: 母; Mounting Type: 侧插; Number of Contacts: 4P; Number of Ports: 1; Current Rating-Power: 1.5A; Voltage Rating: 30V; Length: 19.4mm; Detection color: 白色; Operating Temperature: -20℃~+70℃
Q2 = BSN20_C116157: 数量:1个N沟道;漏源电压(Vdss):50V;连续漏极电流(Id):100mA;导通电阻(RDS(on)):10Ω@2.75V,0.2A;耗散功率(Pd):-;阈值电压(Vgs(th)):1.5V@250uA;; LCSC Part Name: 1个N沟道 耐压:50V 电流:0.1A; Supplier Part: C116157; Manufacturer: SHIKUES(时科); Supplier Footprint: SOT-23; JLCPCB Part Class: Extended Part; Datasheet: https://item.szlcsc.com/datasheet/BSN20/117410.html; Supplier: LCSC; Number: 1个N沟道; Drain to Source Voltage: 50V; Current - Continuous Drain(Id): 100mA; RDS(on): 10Ω@2.75V,0.2A; Gate Threshold Voltage (Vgs(th)): 1.5V@250uA; Input Capacitance(Ciss): 40pF; Reverse Transfer Capacitance (Crss@Vds): 10pF; Type: N沟道; Output Capacitance(Coss): 15pF
Q3 Q4 = MMBT3904_C7420353: 晶体管类型:NPN;集电极电流(Ic):200mA;集射极击穿电压(Vceo):40V;耗散功率(Pd):200mW;直流电流增益(hFE):100@10mA,1.0V;; LCSC Part Name: hFE:100-300，丝印:1AM NPN 电流:200mA 电压:40V; Supplier Part: C7420353; Manufacturer: R+O(宏嘉诚); Supplier Footprint: SOT-23; JLCPCB Part Class: Extended Part; Datasheet: https://item.szlcsc.com/datasheet/MMBT3904/8397175.html; Supplier: LCSC; type: NPN; Current - Collector(Ic): 200mA; Collector - Emitter Voltage VCEO: 40V; Pd - Power Dissipation: 200mW; DC Current Gain: 100@10mA,1.0V; Transition frequency(fT): 300MHz; Current - Collector Cutoff: 100nA; Vce Saturation(VCE(sat)): 300mV; Operating Temperature: -55℃~+150℃; Emitter-Base Voltage(Vebo): 6V
U6 U7 = HX SK12D07VG3: 电路结构:单刀双掷;安装方式:弯插;开关颜色:黑色;额定电流:300mA;额定电压:50V;工作寿命:8千次;; LCSC Part Name: 3脚2两档位SK12D07VG3 1P2T卧式拨动开关,柄长3mm; Supplier Part: C5149832; Manufacturer: hanxia(韩下); Supplier Footprint: 弯插,8.7x4.7mm; JLCPCB Part Class: Extended Part; Datasheet: https://item.szlcsc.com/datasheet/HX%2520SK12D07VG3/5774346.html; Supplier: LCSC; Circuit: 单刀双掷; Actuator Style: 矩形柱状; Termination Style: PC引脚; Length: 8.7mm; Width: 4.7mm; Switch Height: 7.4mm; Mounting Type: 弯插; Actuator Color: 黑色; Current Rating: 300mA; Voltage Rating: 50V; Life: 8千次; Operating Temperature: -25℃~+70℃
FB1 FB2 = CBM160808U000T: 阻抗@频率:0Ω@100MHz;直流电阻(DCR):10mΩ;; LCSC Part Name: 单路 0603磁珠 阻抗0Ω@100MHz; Supplier Part: C394410; Manufacturer: FH(风华); Supplier Footprint: 0603; JLCPCB Part Class: Extended Part; Datasheet: https://item.szlcsc.com/datasheet/CBM160808U000T/373685.html; Supplier: LCSC; Impedance @ Frequency: 0Ω@100MHz; DC Resistance(DCR): 10mΩ; Current Rating: 6A; Number of Circuits: 1; Operating Temperature: -55℃~+125℃
L2 = MMZ1608S121ATA00: 阻抗@频率:120Ω@100MHz;误差:±25%;直流电阻(DCR):200mΩ;; LCSC Part Name: 单路 0603磁珠 阻抗120Ω@100MHz; Supplier Part: C136223; Manufacturer: TDK; Supplier Footprint: 0603; JLCPCB Part Class: Extended Part; Datasheet: https://item.szlcsc.com/datasheet/MMZ1608S121ATA00/147538.html; Supplier: LCSC; Impedance @ Frequency: 120Ω@100MHz; Tolerance: ±25%; DC Resistance(DCR): 200mΩ; Current Rating: 500mA; Number of Circuits: 1; Operating Temperature: -55℃~+125℃
OSC1 = YF4024M00033001: LCSC Part Name: 24M ±20ppm 1.8~3.3V; Supplier Part: C7503132; Manufacturer: HUAXIN(华昕); Supplier Footprint: SMD3225-4P; JLCPCB Part Class: Extended Part; Datasheet: https://item.szlcsc.com/datasheet/YF4024M00033001/8591324.html; Supplier: LCSC
R31-R35 = FRC0402F3002TS: 电阻类型:厚膜电阻;阻值:30kΩ;精度:±1%;功率:62.5mW;工作电压:50V;温度系数:±100ppm/℃;; LCSC Part Name: 30kΩ ±1% 62.5mW 厚膜电阻; Supplier Part: C2909347; Manufacturer: FOJAN(富捷); Supplier Footprint: 0402; JLCPCB Part Class: Extended Part; Supplier: LCSC; Type: 厚膜电阻; Tolerance: ±1%; Power(Watts): 62.5mW; Voltage-Supply(Max): 50V; Temperature Coefficient: ±100ppm/℃; Operating Temperature: -55℃~+155℃
R38 = FRC0402F33R0TS: 电阻类型:厚膜电阻;阻值:33Ω;精度:±1%;功率:62.5mW;工作电压:50V;温度系数:±100ppm/℃;; LCSC Part Name: 33Ω ±1% 62.5mW 厚膜电阻; Supplier Part: C2906868; Manufacturer: FOJAN(富捷); Supplier Footprint: 0402; JLCPCB Part Class: Extended Part; Supplier: LCSC; Type: 厚膜电阻; Tolerance: ±1%; Power(Watts): 62.5mW; Voltage-Supply(Max): 50V; Temperature Coefficient: ±100ppm/℃; Operating Temperature: -55℃~+155℃
R39 = 0402WGF220JTCE: 电阻类型:厚膜电阻;阻值:22Ω;精度:±1%;功率:62.5mW;最大工作电压:50V;温度系数:±100ppm/℃;; LCSC Part Name: 22Ω ±1% 62.5mW 厚膜电阻; Supplier Part: C25092; Manufacturer: UNI-ROYAL(厚声); Supplier Footprint: 0402; JLCPCB Part Class: Basic Part; Datasheet: https://atta.szlcsc.com/upload/public/pdf/source/20200306/C422600_1E6D84923E4A46A82E41ADD87F860B5C.pdf; Supplier: LCSC; Type: 厚膜电阻; Tolerance: ±1%; Power(Watts): 62.5mW; Overload Voltage (Max): 50V; Temperature Coefficient: ±100ppm/℃; Operating Temperature Range: -55℃~+155℃
RF1 = BWIPX-1-001E: 连接器类型:板端;接口类型:内针;端口数量:1;接口直径:2mm;接口长度/高度:1.25mm;频率:6GHz;射频系列:IPEX;阻抗:50Ω;样式:-;工作温度:-40℃~+85℃;; LCSC Part Name: 内针 IPEX; Supplier Part: C496552; Manufacturer: BAT WIRELESS(蝙蝠无线); Supplier Footprint: SMD; JLCPCB Part Class: Extended Part; Datasheet: https://item.szlcsc.com/datasheet/BWIPX-1-001E/508501.html; Supplier: LCSC; Connector Type: 板端; Interface: 内针; Number of Ports: 1; Interface Diameter: 2mm; Interface Length/Height: 1.25mm; RF Series: IPEX; Impedance: 50Ω; Operating Temperature Range: -40℃~+85℃
U11 = XR829 module 24MHz: Supplier Part: C5365288; Manufacturer: x-powers; Supplier Footprint: SMD,12x12mm; JLCPCB Part Class: Extended Part; Datasheet: https://item.szlcsc.com/datasheet/XR829%2520module%252024MHz/6196369.html; Supplier: LCSC

## Nets
+5V: C34.1 C35.2 C36.2 D2.2(A) D3.2 D10.2(A) H3.1 J2.1 P1.1(VCC) R5.1 R6.2
AGND: C58.2 C59.2 D7.1 D8.1 D9.1 J5.1 J7.1 J8.1 R30.1 R52.1 U15.1 U15.5 U15.7 U15.11 U15.13 U15.17
AVCC: C10.2 C11.2 C58.1 C59.1 R7.2 U3.5(OUT) U15.2
GND: C1.1 C2.1 C3.1 C4.1 C6.1 C7.1 C8.1 C9.1 C10.1 C11.1 C12.1 C13.1 C14.1 C15.1 C16.1 C17.2 C18.2 C19.2 C20.2 C21.2 C22.2 C23.2 C24.2 C25.2 C26.2 C27.2 C28.2 C29.2 C30.2 C31.2 C32.2 C33.2 C34.2 C35.1 C36.1 C37.1 C38.1 C39.1 C40.1 C43.1 C44.1 C45.2 C46.2 C47.1 C48.1 C49.1 C50.1 C51.1 C52.2 C53.2 C54.2 C55.1 C56.1 C60.2 C61.2 C62.2 C63.2 C64.2 C65.2 C66.2 C67.2 C68.2 D1.2(A) D3.1 D4.1 D5.1 D6.2 D11.1 D12.1 D13.1 D14.1 ESD1.1 H1.1 H4.1 J1.2 J1.3 J3.1 J4.2 J6.13(S) J6.14(S) J9.5 OSC1.2(GND) P1.4(GND) Q3.2(E) Q4.2(E) R4.1 R10.2 R24.1 R25.1 R37.1 R49.1 R52.2 RF1.2(GND) RF1.3(GND) U1.2(GND) U2.2(GND) U3.2(GND) U4.A6(VSS) U4.C4(VSS) U4.E7(VSS) U4.G5(VSS) U4.H10(VSS) U4.J5(VSS) U4.K8(VSS) U4.N2(VSS) U4.N5(VSS) U4.P4(VSS) U4.P6(VSS) U5.13(VSS) U5.25(VSS) U5.48(VSS) U6.3 U7.3 U11.1(GND1) U11.3(GND2) U11.20(GND3) U11.31(GND4) U11.33(GND5) U11.36(GND6) U15.14 U15.18 U15.22 U15.26 U15.28 U15.30 U15.31 U15.32 U15.33 U15.36 U15.42 U15.57 U15.60 U15.65 U15.66 U15.67 U15.72 U15.73 U15.77 U15.85
VBAT: C47.2 C48.2 FB2.2 U11.9(VBAT)
VCC-3V3: C7.2 C8.2 C14.2 H5.1 L2.1 Q1.2(S) R8.1 U2.5(OUT)
VCC-5V: C1.2 C2.2 C6.2 C9.2 D2.1(C) R1.2 R5.2 U1.4(VIN) U2.1(VIN) U2.3(EN) U3.1(VIN)
VCC-IO: C15.2 C16.2 C21.1 C22.1 C23.1 C24.1 C25.1 C26.1 C27.1 C28.1 C29.1 C30.1 C31.1 C32.1 C33.1 C60.1 C61.1 C62.1 C63.1 C64.1 C65.1 C66.1 C67.1 C68.1 D15.2(A) H6.1 J3.4 J4.6 Q1.3(D) Q2.1(G) R7.1 R11.2 R12.2 R13.2 R14.2 R16.2 R17.2 R40.1 R41.1 U4.C6(VCCQ) U4.E6(VCC) U4.F5(VCC) U4.J10(VCC) U4.M4(VCCQ) U4.N4(VCCQ) U4.P3(VCCQ) U4.P5(VCCQ) U5.12(VCC) U5.34(VCC) U5.37(VCC) U5.39(VCC) U15.27 U15.34 U15.37 U15.54 U15.69 U15.71 U15.89
VCC-IO-EN: Q1.1(G) R10.1
VCC-IR-1: C37.2 J9.1 R23.2
VCC-RTC: J4.3 R8.2 R9.1 R20.2 R23.1
VCC-WIFI-IO: C3.2 C4.2 C5.1 FB1.1 FB2.1 H2.1 L1.2 R2.2 R31.2 R32.2 R33.2 R34.2 R35.2
VDD-IO: C43.2 C44.2 FB1.2 U11.22(VDDIO)
ANTOUT: C46.1 R36.2 U11.2(ANT)
AUDIO-L: D8.2 J7.2 R28.2
AUDIO-R: D7.2 J8.2 R29.2
CPUX-TCK: TP3.1 U15.41
CPUX-TDI: TP1.1 U15.45
CPUX-TDO: TP4.1 U15.49
CPUX-TMS: TP2.1 U15.53
CPUX-URX: Q2.2(S) R17.1 R21.1 U15.6
CPUX-UTX: J3.3 U15.61
DCIN: D1.1(K) ESD1.2 J1.1 J2.2 R6.1
EMMC-CLK: U4.M6(CLK) U15.70
EMMC-CMD: U4.M5(CMD) U15.74
EMMC-D0: U4.A3(DAT0) U15.87
EMMC-D1: U4.A4(DAT1) U15.83
EMMC-D2: U4.A5(DAT2) U15.79
EMMC-D3: U4.B2(DAT3) U15.86
EMMC-D4: U4.B3(DAT4) U15.90
EMMC-D5: U4.B4(DAT5) U15.81
EMMC-D6: U4.B5(DAT6) U15.78
EMMC-D7: U4.B6(DAT7) U15.75
EMMC-RST: U4.K5(RSTN) U15.38
EPHY-LINK-LED: C56.2 J6.12(R-)
EPHY-RXN: RN1.4 U15.100
EPHY-RXP: RN1.3 U15.98
EPHY-SPD-LED: C55.2 J6.10(L-)
EPHY-TXN: RN1.2 U15.97
EPHY-TXP: RN1.1 U15.95
HCEC: R50.1 U15.24
HDMI-5V: D10.1(K) R47.2 R48.2
HPD: D11.2 R46.2
HTX0N: U15.52
HTX0P: U15.56
HTX1N: U15.64
HTX1P: U15.68
HTX2N: U15.76
HTX2P: U15.80
HTXCN: U15.40
HTXCP: U15.44
IR-RX: J4.1 R22.1 U15.82
IR-RX-1: C39.2 J9.3 R22.2
LED1: C38.2 J4.4 J9.2 R27.2
LED2: C40.2 J4.5 J9.4 R26.2
LINEOUTL: C42.1 U15.3
LINEOUTR: C41.1 U15.9
NALE: U5.17(ALE) U15.21
NCE0: U5.9(CE#) U15.25
NCE1: U5.10(CE2#) U15.23
NCLE: U5.16(CLE) U15.19
NDQ0: U5.29(I/O0) U15.63
NDQ1: U5.30(I/O1) U15.59
NDQ2: U5.31(I/O2) U15.55
NDQ3: U5.32(I/O3) U15.51
NDQ4: U5.41(I/O4) U15.47
NDQ5: U5.42(I/O5) U15.43
NDQ6: U5.43(I/O6) U15.39
NDQ7: U5.44(I/O7) U15.35
NRB0: R16.1 U5.7(R/B#)
NRB1: R14.1 R15.2
NRBX: R15.1 U5.6(R/B2#)
NRE: U5.8(RE#) U15.29
NWE: U5.18(WE#) U15.10
NWP: C17.1 R11.1 U5.19(WP#)
PWR-LED: R18.1 U15.8
PWR-STB: R9.2 U3.3(EN)
RECOVERY: R20.1 U6.1 U6.2 U15.62
STATUS-LED: R19.1 U15.4
TV-OUT: D9.2 J5.2 R30.2 U15.15
TX1-CEC: D14.2 R50.2 R51.2
TX1-DSCL: D13.2 R47.1 U15.16
TX1-DSDA: D12.2 R48.1 U15.20
TX1-HPD: R46.1 R49.2 U15.12
UBOOT: D6.1 U7.1 U7.2 U15.58
USB-DM: D4.2 P1.2(D-) U15.91
USB-DP: D5.2 P1.3(D+) U15.93
VPS0: R12.1 U5.36(VSS)
VPS1: C20.1 R13.1 U5.28(NC)
WIFI-EN: R38.1 U11.12(WL-REG-ON) U15.92
WIFI-IO-FB: C5.2 R2.1 R4.2 U1.5(FB/Vout)
WIFI-POWER-EN: R3.1 U15.88
WIFI-PWR-STB: R1.1 R3.2 U1.1(EN)
WL-SDIO-CLK: C49.2 R38.2 U11.17(SDIO-DATA-CLK) U15.48
WL-SDIO-CMD: R33.1 U11.16(SDIO-DATA-CMD) U15.46
WL-SDIO-D0: R31.1 U11.18(SDIO-DATA-DATA0) U15.96
WL-SDIO-D1: R32.1 U11.19(SDIO-DATA-DATA1) U15.94
WL-SDIO-D2: R34.1 U11.14(SDIO-DATA2) U15.99
WL-SDIO-D3: R35.1 U11.15(SDIO-DATA3) U15.50
WL-WAKE-HOST: U11.13(WL-HOST-WAKE) U15.84
XTAL2: R39.1 U11.30(TCXO-IN)
Net-(C12-2): C12.2 U2.4(NC)
Net-(C13-2): C13.2 U3.4(NC)
Net-(C18-1): C18.1 C19.1 U4.C2(VDDI)
Net-(C41-2): C41.2 R28.1
Net-(C42-2): C42.2 R29.1
Net-(C45-1): C45.1 R36.1 RF1.1(SIG)
Net-(C50-2): C50.2 C51.2 L2.2 OSC1.4(VDD)
Net-(C52-1): C52.1 U12.2
Net-(C53-1): C53.1 U12.7
Net-(C54-1): C54.1 R42.1 R43.1 R44.1 R45.1
Net-(D15-1): D15.1(K) R51.1
Net-(J3-2): J3.2 Q2.3(D) R21.2
Net-(J6-1): J6.1 U12.16
Net-(J6-2): J6.2 U12.14
Net-(J6-3): J6.3 U12.11
Net-(J6-4): J6.4 J6.5 R44.2
Net-(J6-6): J6.6 U12.9
Net-(J6-7): J6.7 J6.8 R45.2
Net-(J6-9): J6.9(L+) R40.2
Net-(J6-11): J6.11(R+) R41.2
Net-(L1-1): L1.1 U1.3(LX)
Net-(OSC1-3): OSC1.3(OUT) R39.2
Net-(Q3-1): Q3.1(B) R18.2 R24.2
Net-(Q3-3): Q3.3(C) R27.1
Net-(Q4-1): Q4.1(B) R19.2 R25.2
Net-(Q4-3): Q4.3(C) R26.1
Net-(R37-2): R37.2 U11.24(LPO)
Net-(R42-2): R42.2 U12.10
Net-(R43-2): R43.2 U12.15
Net-(RN1-5): RN1.5 U12.8
Net-(RN1-6): RN1.6 U12.6
Net-(RN1-7): RN1.7 U12.3
Net-(RN1-8): RN1.8 U12.1

Not connected (* = marked no-connect by the designer): C57 1 2; MARK1 1*; MARK2 1*; MARK3 1*; MARK4 1*; MARK5 1*; MARK6 1*; OSC1 1(Tri-Stata)*; P1 5(EH)*; SCREW1 1*; SCREW2 1*; SCREW3 1*; SCREW4 1*; SCREW5 1*; U4 A1(NC)* A2(NC)* A7(RFU)* A8(NC)* A9(NC)* A10(NC)* A11(NC)* A12(NC)* A13(NC)* A14(NC)* B1(NC)* B7(NC)* B8(NC)* B9(NC)* B10(NC)* B11(NC)* B12(NC)* B13(NC)* B14(NC)* C1(NC)* C3(NC)* C5(NC)* C7(NC)* C8(NC)* C9(NC)* C10(NC)* C11(NC)* C12(NC)* C13(NC)* C14(NC)* D1(NC)* D2(NC)* D3(NC)* D4(NC)* D12(NC)* D13(NC)* D14(NC)* E1(NC)* E2(NC)* E3(NC)* E5(RFU)* E8(RFU)* E9(RFU)* E10(RFU)* E12(NC)* E13(NC)* E14(NC)* F1(NC)* F2(NC)* F3(NC)* F10(RFU)* F12(NC)* F13(NC)* F14(NC)* G1(NC)* G2(NC)* G3(RFU)* G10(RFU)* G12(NC)* G13(NC)* G14(NC)* H1(NC)* H2(NC)* H3(NC)* H5(DataStrobe)* H12(NC)* H13(NC)* H14(NC)* J1(NC)* J2(NC)* J3(NC)* J12(NC)* J13(NC)* J14(NC)* K1(NC)* K2(NC)* K3(NC)* K6(RFU)* K7(RFU)* K9(VDDF)* K10(RFU)* K12(NC)* K13(NC)* K14(NC)* L1(NC)* L2(NC)* L3(NC)* L12(NC)* L13(NC)* L14(NC)* M1(NC)* M2(NC)* M3(NC)* M7(NC)* M8(NC)* M9(NC)* M10(NC)* M11(NC)* M12(NC)* M13(NC)* M14(NC)* N1(NC)* N3(NC)* N6(NC)* N7(NC)* N8(NC)* N9(NC)* N10(NC)* N11(NC)* N12(NC)* N13(NC)* N14(NC)* P1(NC)* P2(NC)* P7(RFU)* P8(NC)* P9(NC)* P10(RFU)* P11(NC)* P12(NC)* P13(NC)* P14(NC)*; U5 1(NC)* 2(NC)* 3(NC)* 4(NC)* 5(NC)* 11(NC)* 14(NC)* 15(NC)* 20(NC)* 21(NC)* 22(NC)* 23(NC)* 24(NC)* 26(DNU)* 27(NC)* 33(NC)* 35(NC)* 38(DNU)* 40(NC)* 45(NC)* 46(NC)* 47(DNU)*; U6 4* 5*; U7 4* 5*; U11 4(NC1)* 5(NC2)* 6(BT-WAKE)* 7(BT-HOST-WAKE)* 8(NC3)* 10(NC4)* 11(NC5)* 21(NC6)* 23(NC7)* 25(PCM-OUT)* 26(PCM-CLK)* 27(PCM-IN)* 28(PCM-SYNC)* 29(NC8)* 32(NC9)* 34(BT-RST-N)* 35(NC10)* 37(NC11)* 38(NC12)* 39(NC13)* 40(NC14)* 41(UART-RTS-N)* 42(UART-TXD)* 43(UART-RXD)* 44(UART-CTS-N)*; U12 4* 5* 12* 13*; U13 1(ESD1) 2(ESD2) 3(GND) 4(ESD3) 5(ESD4) 6(NC) 7(NC) 8(V+) 9(NC) 10(NC)

## Notes on the sheets
sheet 1
- BTB
- 光学定位点、螺钉孔、测试插针
- 邮票孔
sheet 2
- POWER
- VCC-WIFI  3.3V/1A
- AVCC  3.3V/0.3A
- VCC-3V3  3.3V/0.3A
- VCCIO 3.3V
sheet 3
- eMMC
- NAND
sheet 4
- KEY
- USB
- USB差分对阻抗90Ω，即线宽/线距/线宽为：6mil/8mil/6mil
- LED
- 3V3
- RX
- TX
- GND
sheet 5
- AV
- TV-OUT单端阻抗37.5Ω，即线宽为10mil。
sheet 6
- WIFI
- 50Ω单端阻抗，即线宽6mil
- -
- 最大电路：400mA
sheet 7
- EPHY-RX/EPHY-TX 差分对阻抗 100Ω；
  即线宽/线距/线宽为：5mil/8mil/5mil
sheet 8
- 原理图抄画区域
- HDMI
